# Altium project EXP_HW_V4.PrjPcb
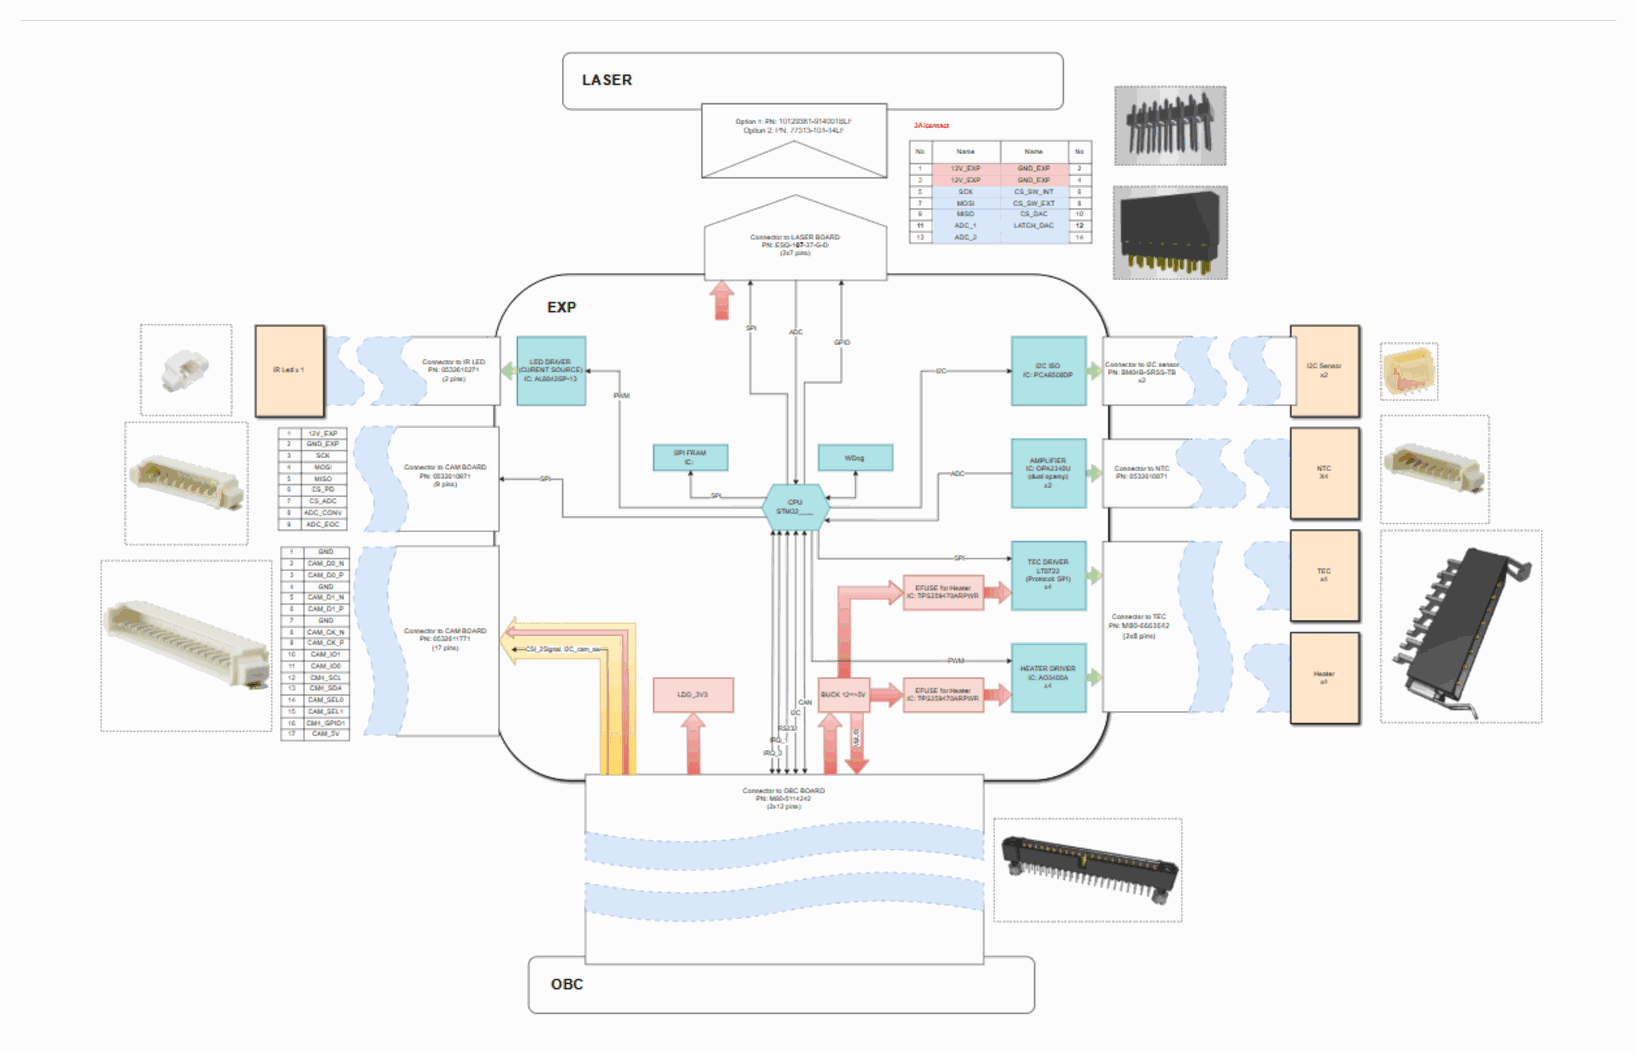
[diagram p0: Block_Diagram.SchDoc]
13 sheets, 359 parts. Net scope: global (net labels, ports and power ports of the same name join across sheets).
Board file: EXP_V122.PcbDoc
Sheets:
  Block_Diagram.SchDoc
  History.SchDoc
  HEADER_1.SchDoc
  HEADER_2.SchDoc
  POWER.SchDoc
  TEC_DRV.SchDoc
  HEATER.SchDoc
  NTC.SchDoc
  I2C_Sensor.SchDoc
  IR_LED.SchDoc
  FRAM.SchDoc
  MCU.SchDoc
  RS485.SchDoc

## Sheet Block_Diagram.SchDoc
size 420 x 297 mm; SheetNumber: 1; SheetTotal: 12

### Notes on the sheet
- Project:
- BEE-PC1
- Sub-system:
- NANORACK_EXP_CONTROLLER
- Design by:
- SANG HUYNH
- BAO BUI Q.
- Sheet title:
- Sheet
- A3
- of
- Checked by:
- Approved by:
- VU PHAM
- Revision:
- Document No:
- V1.1.1
- Size:
- Date:

## Sheet History.SchDoc
size 420 x 297 mm; SheetNumber: 2; SheetTotal: 13
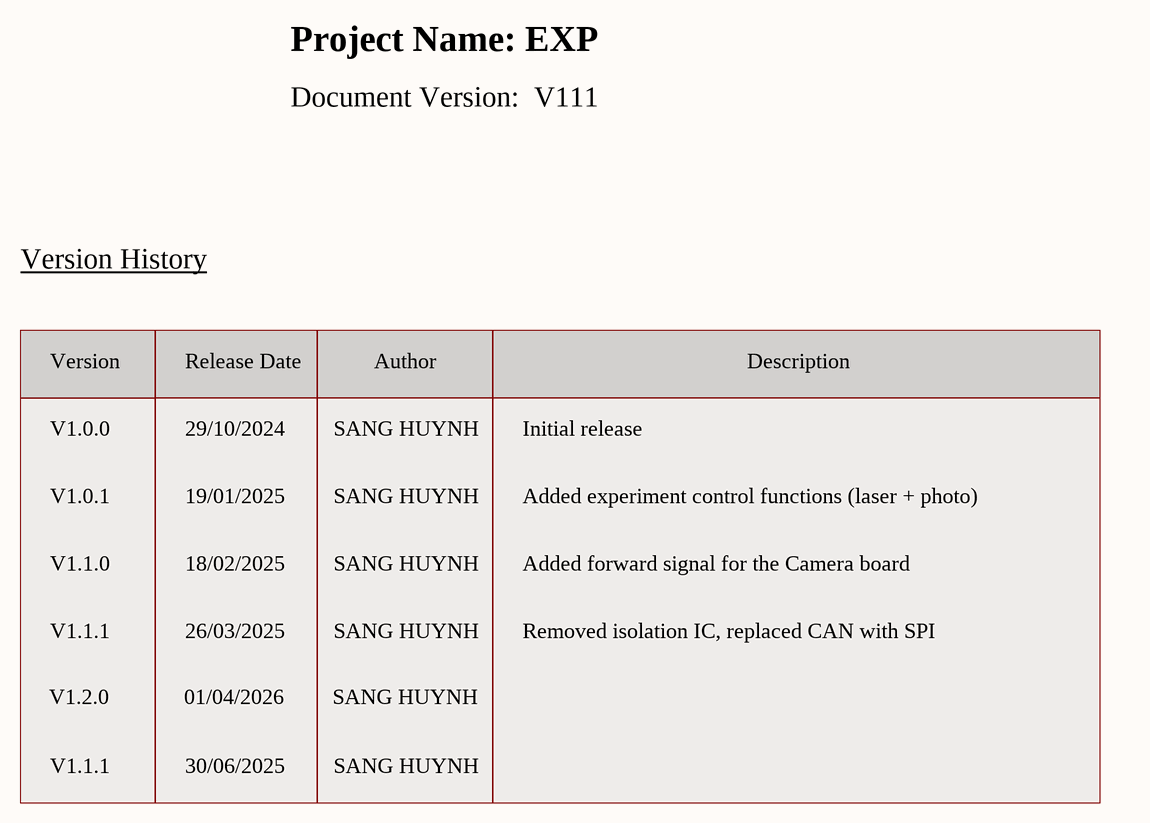
[diagram p1: History.SchDoc]

### Notes on the sheet
- Project Name: EXP
- Document Version:  V111
- Version History
- Version
- Release Date
- Author
- Description
- V1.0.0
- 29/10/2024
- SANG HUYNH
- Initial release
- V1.0.1
- 19/01/2025
- Added experiment control functions (laser + photo)
- V1.1.0
- 18/02/2025
- Added forward signal for the Camera board
- V1.1.1
- 26/03/2025
- Removed isolation IC, replaced CAN with SPI
- V1.2.0
- 01/04/2026
- 30/06/2025
- Project:
- BEE-PC1
- Sub-system:
- NANORACK_EXP_CONTROLLER
- Design by:
- BAO BUI Q.
- Sheet title:
- Sheet
- A3
- of
- Checked by:
- Approved by:
- VU PHAM
- Revision:
- Document No:
- Size:
- Date:

## Sheet HEADER_1.SchDoc
size 420 x 297 mm; SheetNumber: 3; SheetTotal: 13
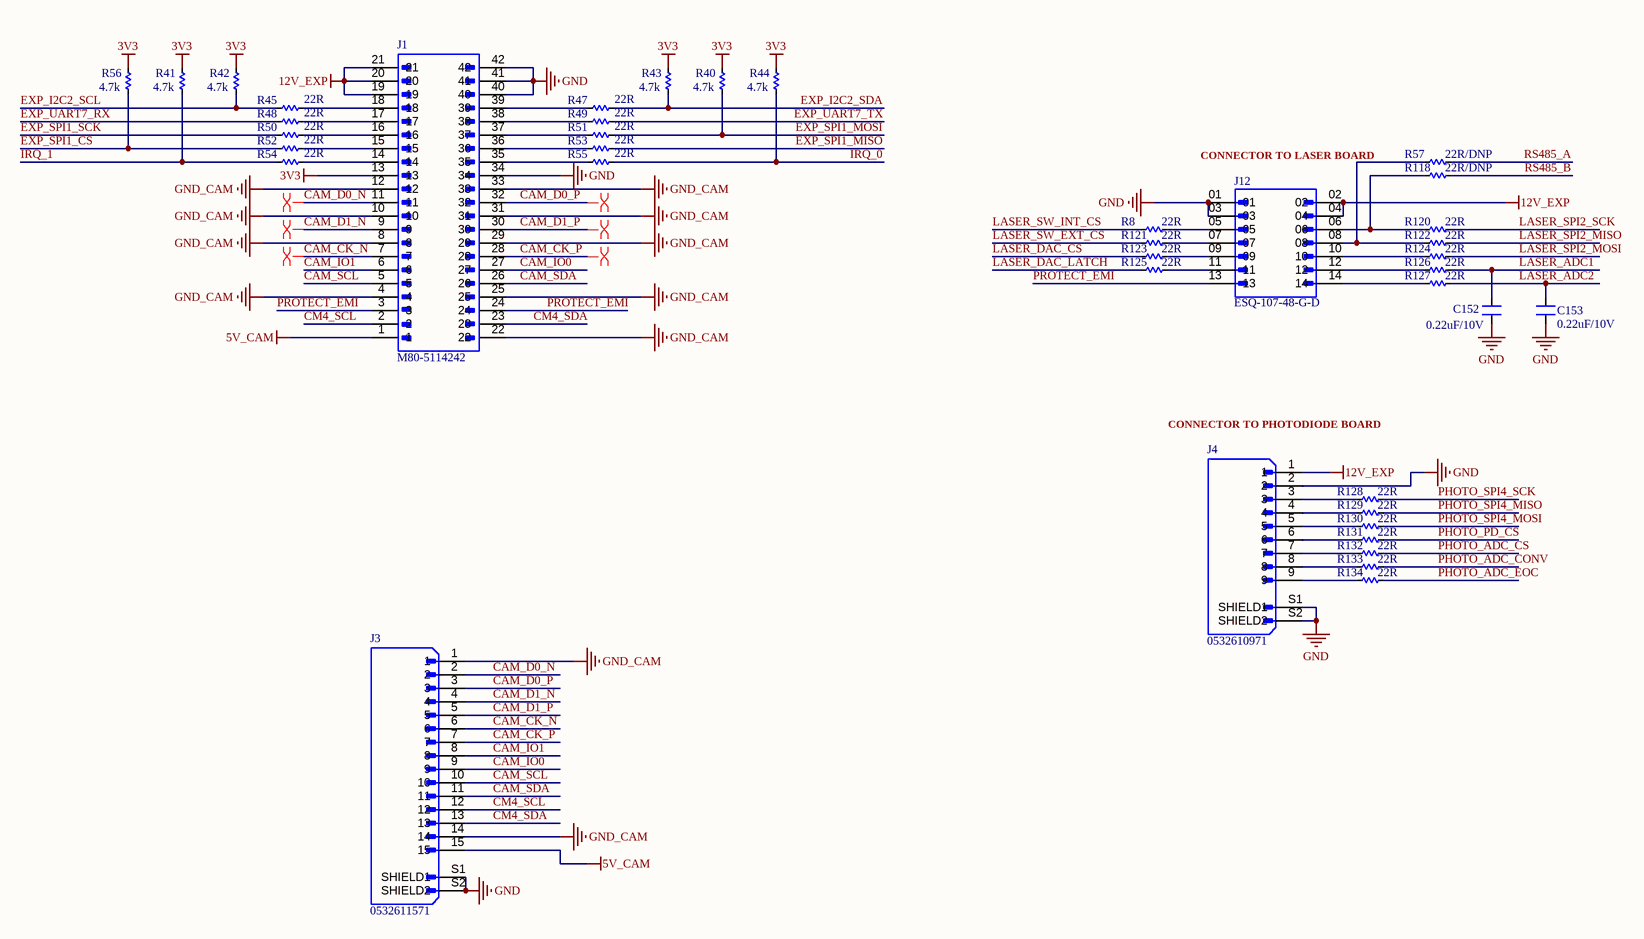
[diagram p2: HEADER_1.SchDoc]

### Parts
C152  0.22uF/10V  [CAP_C_1608X80]
C153  0.22uF/10V  [CAP_C_1608X80]
J1  M80-5114242  [M80-5114242]
J3  0532611571  [0532611571]
J4  0532610971  [0532610971]
J12  ESQ-107-48-G-D  [ESQ-107-37-G-D]
R8  22R  [RES_C_1608X60]
R40  4.7k  [RES_C_1608X60]
R41  4.7k  [RES_C_1608X60]
R42  4.7k  [RES_C_1608X60]
R43  4.7k  [RES_C_1608X60]
R44  4.7k  [RES_C_1608X60]
R45  22R  [RES_C_1608X60]
R47  22R  [RES_C_1608X60]
R48  22R  [RES_C_1608X60]
R49  22R  [RES_C_1608X60]
R50  22R  [RES_C_1608X60]
R51  22R  [RES_C_1608X60]
R52  22R  [RES_C_1608X60]
R53  22R  [RES_C_1608X60]
R54  22R  [RES_C_1608X60]
R55  22R  [RES_C_1608X60]
R56  4.7k  [RES_C_1608X60]
R57  22R/DNP  [RES_C_1608X60]
R118  22R/DNP  [RES_C_1608X60]
R120  22R  [RES_C_1608X60]
R121  22R  [RES_C_1608X60]
R122  22R  [RES_C_1608X60]
R123  22R  [RES_C_1608X60]
R124  22R  [RES_C_1608X60]
R125  22R  [RES_C_1608X60]
R126  22R  [RES_C_1608X60]
R127  22R  [RES_C_1608X60]
R128  22R  [RES_C_1608X60]
R129  22R  [RES_C_1608X60]
R130  22R  [RES_C_1608X60]
R131  22R  [RES_C_1608X60]
R132  22R  [RES_C_1608X60]
R133  22R  [RES_C_1608X60]
R134  22R  [RES_C_1608X60]

### Nets
3V3: J1.13 R40.1 R41.1 R42.1 R43.1 R44.1 R56.1  [project net +3.3]
5V_CAM: J1.1 J3.15
12V_EXP: J1.19 J1.20 J1.21 J4.1 J12.02 J12.04
GND: C152.1 C153.1 J1.34 J1.40 J1.41 J1.42 J3.S1(SHIELD1) J3.S2(SHIELD2) J4.2 J4.S1(SHIELD1) J4.S2(SHIELD2) J12.01 J12.03
GND_CAM: J1.4 J1.8 J1.10 J1.12 J1.22 J1.25 J1.29 J1.31 J1.33 J3.1 J3.14
CAM_CK_N: J1.7 J3.6
CAM_CK_P: J1.28 J3.7
CAM_D0_N: J1.11 J3.2
CAM_D0_P: J1.32 J3.3
CAM_D1_N: J1.9 J3.4
CAM_D1_P: J1.30 J3.5
CAM_IO0: J1.27 J3.9
CAM_IO1: J1.6 J3.8
CAM_SCL: J1.5 J3.10
CAM_SDA: J1.26 J3.11
CM4_SCL: J1.2 J3.12
CM4_SDA: J1.23 J3.13
EXP_I2C2_SCL: R42.2 R45.1
EXP_I2C2_SDA: R43.2 R47.2
EXP_SPI1_CS: R52.1 R56.2
EXP_SPI1_MISO: R53.2
EXP_SPI1_MOSI: R40.2 R51.2
EXP_SPI1_SCK: R50.1
EXP_UART7_RX: R48.1
EXP_UART7_TX: R49.2
IRQ_0: R44.2 R55.2
IRQ_1: R41.2 R54.1
LASER_ADC1: C152.2 R126.2
LASER_ADC2: C153.2 R127.2
LASER_DAC_CS: R123.1
LASER_DAC_LATCH: R125.1
LASER_SPI2_MISO: R122.2
LASER_SPI2_MOSI: R124.2
LASER_SPI2_SCK: R120.2
LASER_SW_EXT_CS: R121.1
LASER_SW_INT_CS: R8.1
PHOTO_ADC_CONV: R133.2
PHOTO_ADC_CS: R132.2
PHOTO_ADC_EOC: R134.2
PHOTO_PD_CS: R131.2
PHOTO_SPI4_MISO: R129.2
PHOTO_SPI4_MOSI: R130.2
PHOTO_SPI4_SCK: R128.2
PROTECT_EMI: J1.3 J1.24 J12.13
RS485_A: R57.2
RS485_B: R118.2
NetJ1_14: J1.14 R54.2
NetJ1_15: J1.15 R52.2
NetJ1_16: J1.16 R50.2
NetJ1_17: J1.17 R48.2
NetJ1_18: J1.18 R45.2
NetJ1_35: J1.35 R55.1
NetJ1_36: J1.36 R53.1
NetJ1_37: J1.37 R51.1
NetJ1_38: J1.38 R49.1
NetJ1_39: J1.39 R47.1
NetJ4_3: J4.3 R128.1
NetJ4_4: J4.4 R129.1
NetJ4_5: J4.5 R130.1
NetJ4_6: J4.6 R131.1
NetJ4_7: J4.7 R132.1
NetJ4_8: J4.8 R133.1
NetJ4_9: J4.9 R134.1
NetJ12_05: J12.05 R8.2
NetJ12_06: J12.06 R118.1 R120.1
NetJ12_07: J12.07 R121.2
NetJ12_08: J12.08 R57.1 R122.1
NetJ12_09: J12.09 R123.2
NetJ12_10: J12.10 R124.1
NetJ12_11: J12.11 R125.2
NetJ12_12: J12.12 R126.1
NetJ12_14: J12.14 R127.1

### Layout directives
differential pair; differential pair class DIF100: CAM_CK_N, CAM_CK_P, CAM_D0_N, CAM_D0_P, CAM_D1_N, CAM_D1_P

### Notes on the sheet
- (near J12) CONNECTOR TO LASER BOARD
- (near J4) CONNECTOR TO PHOTODIODE BOARD
- Project:
- BEE-PC1
- Sub-system:
- NANORACK_EXP_CONTROLLER
- Design by:
- SANG HUYNH
- BAO BUI Q.
- Sheet title:
- Sheet
- A3
- of
- Checked by:
- Approved by:
- VU PHAM
- Revision:
- Document No:
- V1.1.1
- Size:
- Date:

### Library data of the parts
C152 C153 = Capacitors: Value: 33pF
J1 = CONN_TH_42: CONN HEADER VERT 42POS 2MM
J3 = CONN_SMD_15: Conn Shrouded Header (4 Sides) HDR 15 POS 1.25mm Solder RA Side Entry SMD PicoBladeâ„¢ T/R; MF: Molex; Package: None; MP: 532611571; Check_prices: https://www.snapeda.com/parts/532611571/Molex/view-part/?ref=eda; Purchase-URL: https://pricing.snapeda.com/search/part/532611571/?ref=eda; Value: *; Availability: In Stock; Price: None; SnapEDA_Link: https://www.snapeda.com/parts/532611571/Molex/view-part/?ref=snap
J4 = CONN_SMD_09: CONN HEADER SMD R/A 9POS 1.25MM
J12 = CONN_TH_14: CONN SOCKET 14POS 0.1 GOLD PCB
R8 R40-R45 R47-R57 R118 R120-R134 = Res SMD: SMD; Manufacturer: Generic Components; Class: Passive; Published: 08/06/2000; Publisher: Altium Hobart Technology Centre

## Sheet HEADER_2.SchDoc
size 420 x 297 mm; SheetNumber: 3; SheetTotal: 11
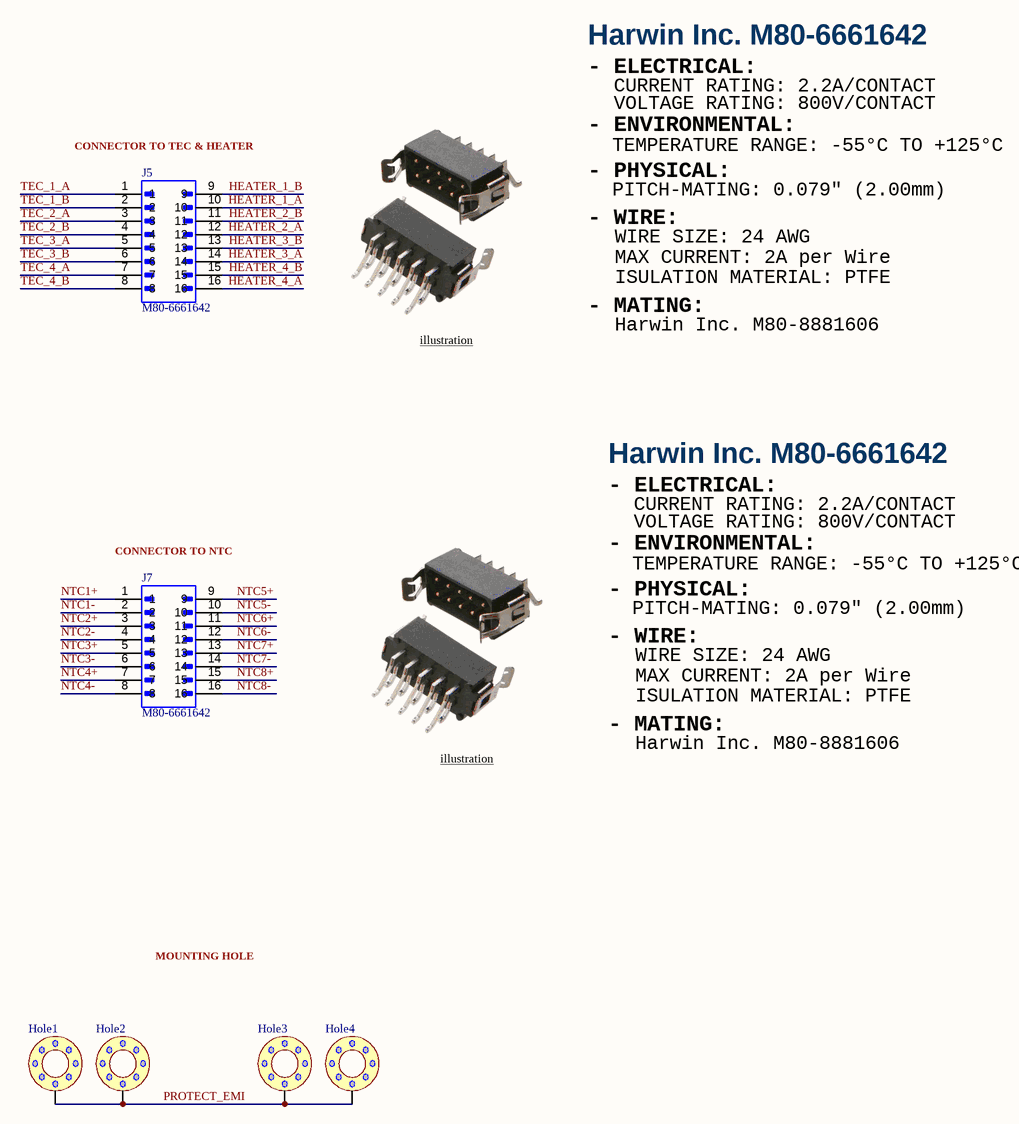
[diagram p3: HEADER_2.SchDoc]

### Parts
Hole1  hole_space  [HOLE_SPACE]  (value not drawn)
Hole2  hole_space  [HOLE_SPACE]  (value not drawn)
Hole3  hole_space  [HOLE_SPACE]  (value not drawn)
Hole4  hole_space  [HOLE_SPACE]  (value not drawn)
J5  M80-6661642  [M80-6661642]
J7  M80-6661642  [M80-6661642]

### Nets
HEATER_1_A: J5.10 J5.12 J5.14 J5.16  [also labelled HEATER_2_A, HEATER_3_A, HEATER_4_A]  [project net 5V_TEMP]
NTC1+: J7.1 J7.3 J7.5 J7.7 J7.9 J7.11 J7.13 J7.15  [also labelled NTC2+, NTC3+, NTC4+, NTC5+, NTC6+, NTC7+, NTC8+]  [project net +3.3]
HEATER_1_B: J5.9
HEATER_2_B: J5.11
HEATER_3_B: J5.13
HEATER_4_B: J5.15
NTC1-: J7.2
NTC2-: J7.4
NTC3-: J7.6
NTC4-: J7.8
NTC5-: J7.10
NTC6-: J7.12
NTC7-: J7.14
NTC8-: J7.16
PROTECT_EMI: Hole1.1 Hole2.1 Hole3.1 Hole4.1
TEC_1_A: J5.1
TEC_1_B: J5.2
TEC_2_A: J5.3
TEC_2_B: J5.4
TEC_3_A: J5.5
TEC_3_B: J5.6
TEC_4_A: J5.7
TEC_4_B: J5.8

### Notes on the sheet
- Harwin Inc. M80-6661642
- - ELECTRICAL:
- CURRENT RATING: 2.2A/CONTACT
- VOLTAGE RATING: 800V/CONTACT
- (near J5) CONNECTOR TO TEC & HEATER
- - ENVIRONMENTAL:
- - PHYSICAL:
- TEMPERATURE RANGE: -55°C TO +125°C
- - WIRE:
- PITCH-MATING: 0.079" (2.00mm)
- WIRE SIZE: 24 AWG
- - MATING:
- MAX CURRENT: 2A per Wire
- ISULATION MATERIAL: PTFE
- illustration
- Harwin Inc. M80-8881606
- (near J7) CONNECTOR TO NTC
- MOUNTING HOLE
- Project:
- BEE-PC1
- Sub-system:
- NANORACK_EXP_CONTROLLER
- Design by:
- SANG HUYNH
- BAO BUI Q.
- Sheet title:
- Sheet
- A3
- of
- Checked by:
- Approved by:
- VU PHAM
- Revision:
- Document No:
- V1.1.1
- Size:
- Date:

### Library data of the parts
J5 J7 = CONN_SMD_16: CONN HEADER SMD R/A 16POS 2MM

## Sheet POWER.SchDoc
size 420 x 297 mm; SheetNumber: 4; SheetTotal: 11
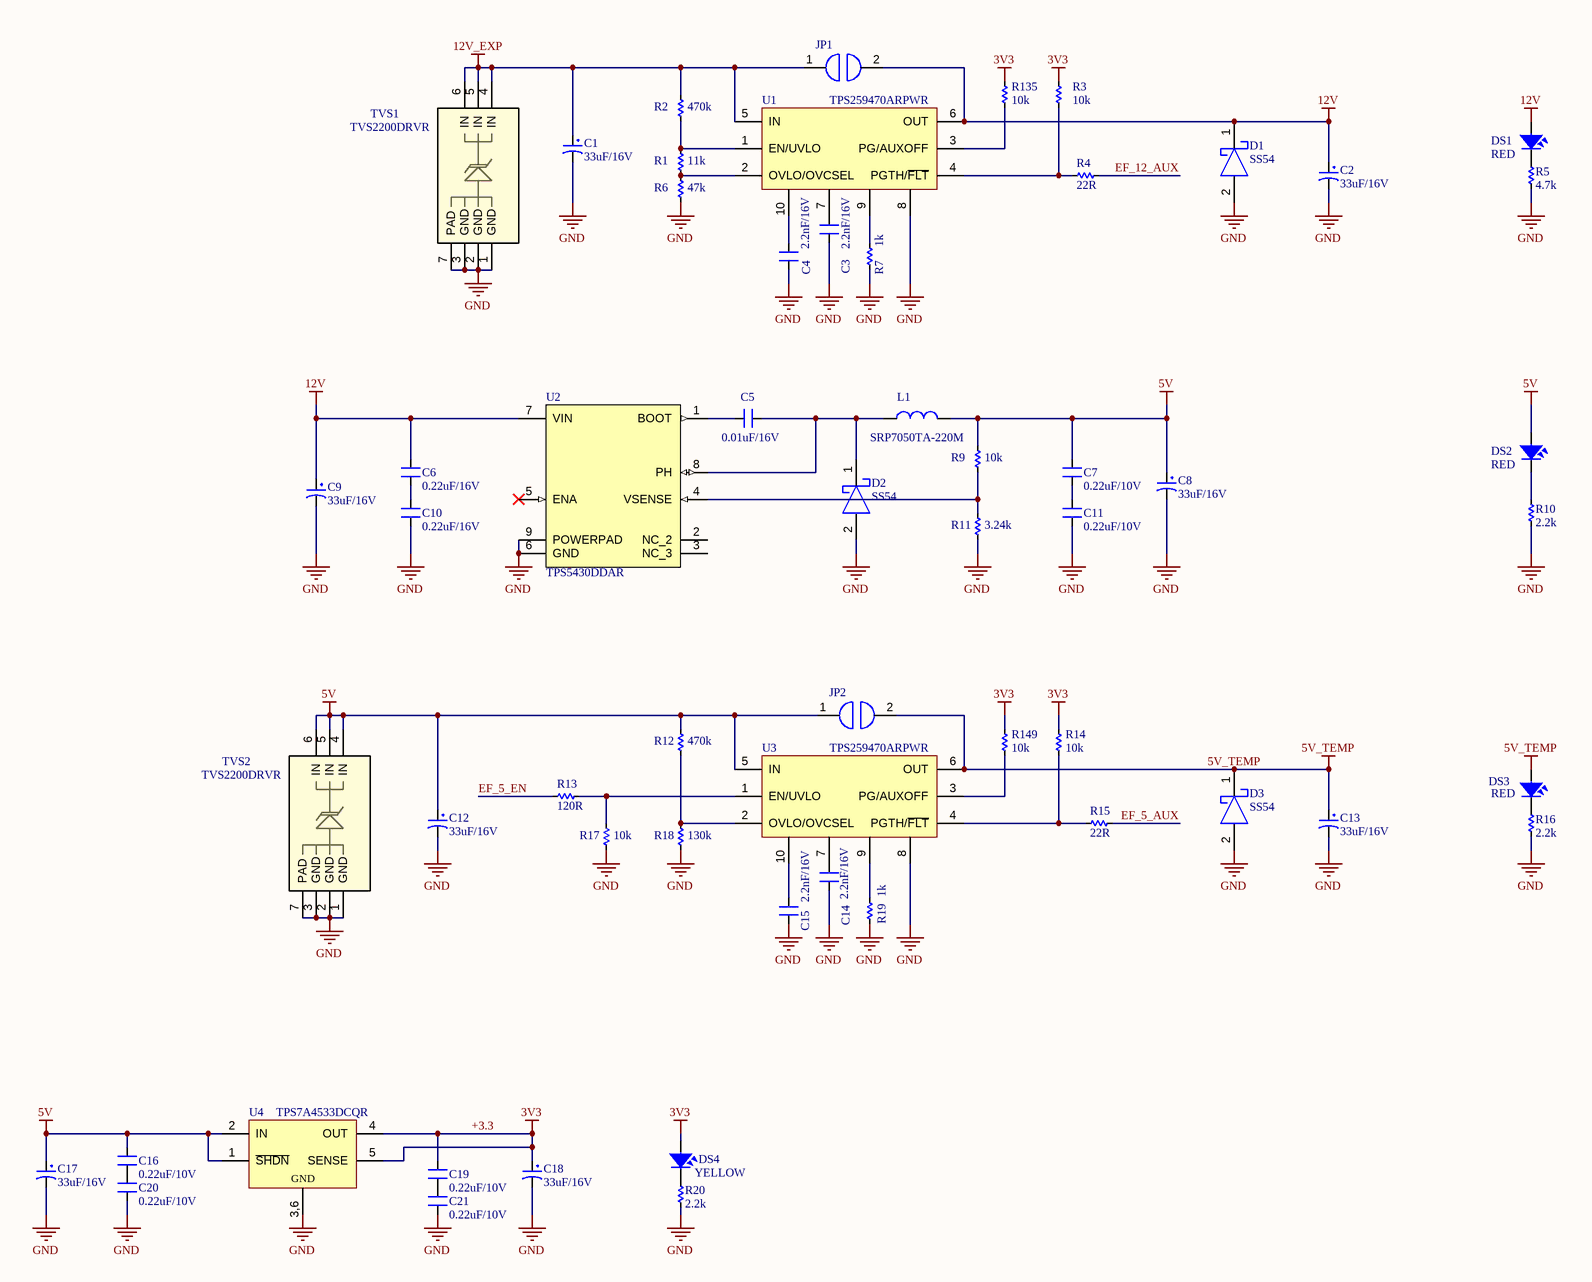
[diagram p4: POWER.SchDoc]

### Parts
C1  33uF/16V  [TANTALUM-SMD-1206]
C2  33uF/16V  [TANTALUM-SMD-1206]
C3  2.2nF/16V  [CAP_C_1608X80]
C4  2.2nF/16V  [CAP_C_1608X80]
C5  0.01uF/16V  [CAP_C_1608X80]
C6  0.22uF/16V  [CAP_C_1608X80]
C7  0.22uF/10V  [CAP_C_1608X80]
C8  33uF/16V  [TANTALUM-SMD-1206]
C9  33uF/16V  [TANTALUM-SMD-1206]
C10  0.22uF/16V  [CAP_C_1608X80]
C11  0.22uF/10V  [CAP_C_1608X80]
C12  33uF/16V  [TANTALUM-SMD-1206]
C13  33uF/16V  [TANTALUM-SMD-1206]
C14  2.2nF/16V  [CAP_C_1608X80]
C15  2.2nF/16V  [CAP_C_1608X80]
C16  0.22uF/10V  [CAP_C_1608X80]
C17  33uF/16V  [TANTALUM-SMD-1206]
C18  33uF/16V  [TANTALUM-SMD-1206]
C19  0.22uF/10V  [CAP_C_1608X80]
C20  0.22uF/10V  [CAP_C_1608X80]
C21  0.22uF/10V  [CAP_C_1608X80]
D1  SS54  [DO214-AC-SMA]
D2  SS54  [DO214-AC-SMA]
D3  SS54  [DO214-AC-SMA]
DS1  RED  [LED-0603-BLUE]
DS2  RED  [LED-0603-BLUE]
DS3  RED  [LED-0603-BLUE]
DS4  YELLOW  [LED-0603-BLUE]
JP1  jumper2  [JUMPER]  (value not drawn)
JP2  jumper2  [JUMPER]  (value not drawn)
L1  SRP7050TA-220M  [PSM6050]
R1  11k  [RES_C_1608X60]
R2  470k  [RES_C_1608X60]
R3  10k  [RES_C_1608X60]
R4  22R  [RES_C_1608X60]
R5  4.7k  [RES_C_1608X60]
R6  47k  [RES_C_1608X60]
R7  1k  [RES_C_1608X60]
R9  10k  [RES_C_1608X60]
R10  2.2k  [RES_C_1608X60]
R11  3.24k  [RES_C_1608X60]
R12  470k  [RES_C_1608X60]
R13  120R  [RES_C_1608X60]
R14  10k  [RES_C_1608X60]
R15  22R  [RES_C_1608X60]
R16  2.2k  [RES_C_1608X60]
R17  10k  [RES_C_1608X60]
R18  130k  [RES_C_1608X60]
R19  1k  [RES_C_1608X60]
R20  2.2k  [RES_C_1608X60]
R135  10k  [RES_C_1608X60]
R149  10k  [RES_C_1608X60]
TVS1  TVS2200DRVR  [TVS2200]
TVS2  TVS2200DRVR  [TVS2200]
U1  TPS259470ARPWR  [VQFN-HR-10]
U2  TPS5430DDAR  [TPS5430DDAR_V3]
U3  TPS259470ARPWR  [VQFN-HR-10]
U4  TPS7A4533DCQR  [SOT223_6]

### Nets
5V: C7.2 C8.1 C12.1 C16.2 C17.1 DS2.1 JP2.1 L1.2 R9.1 R12.1 TVS2.4(IN) TVS2.5(IN) TVS2.6(IN) U3.5(IN) U4.1(~{SHDN}) U4.2(IN)
5V_TEMP: C13.1 D3.1 DS3.1 JP2.2 U3.6(OUT)
12V: C2.1 C6.2 C9.1 D1.1 DS1.1 JP1.2 U1.6(OUT) U2.7(VIN)
12V_EXP: C1.1 JP1.1 R2.1 TVS1.4(IN) TVS1.5(IN) TVS1.6(IN) U1.5(IN)
+3.3: C18.1 C19.2 DS4.1 R3.1 R14.1 R135.1 R149.1 U4.4(OUT) U4.5(SENSE)  [also labelled 3V3]
GND: C1.2 C2.2 C3.1 C4.1 C8.2 C9.2 C10.1 C11.1 C12.2 C13.2 C14.1 C15.1 C17.2 C18.2 C20.1 C21.1 D1.2 D2.2 D3.2 R5.2 R6.2 R7.2 R10.2 R11.2 R16.2 R17.2 R18.2 R19.2 R20.2 TVS1.1(GND) TVS1.2(GND) TVS1.3(GND) TVS1.7(PAD) TVS2.1(GND) TVS2.2(GND) TVS2.3(GND) TVS2.7(PAD) U1.8 U2.6(GND) U2.9(POWERPAD) U3.8 U4.3,6(GND)
EF_5_AUX: R15.2
EF_5_EN: R13.1
EF_12_AUX: R4.2
NetC3_2: C3.2 U1.7
NetC4_2: C4.2 U1.10
NetC5_1: C5.1 D2.1 L1.1 U2.8(PH)
NetC5_2: C5.2 U2.1(BOOT)
NetC6_1: C6.1 C10.2
NetC7_1: C7.1 C11.2
NetC14_2: C14.2 U3.7
NetC15_2: C15.2 U3.10
NetC16_1: C16.1 C20.2
NetC19_1: C19.1 C21.2
NetDS1_2: DS1.2 R5.1
NetDS2_2: DS2.2 R10.1
NetDS3_2: DS3.2 R16.1
NetDS4_2: DS4.2 R20.1
NetR1_1: R1.1 R2.2 U1.1(EN/UVLO)
NetR1_2: R1.2 R6.1 U1.2(OVLO/OVCSEL)
NetR3_2: R3.2 R4.1 U1.4(PGTH/~{FLT})
NetR7_1: R7.1 U1.9
NetR9_2: R9.2 R11.1 U2.4(VSENSE)
NetR12_2: R12.2 R18.1 U3.2(OVLO/OVCSEL)
NetR13_2: R13.2 R17.1 U3.1(EN/UVLO)
NetR14_2: R14.2 R15.1 U3.4(PGTH/~{FLT})
NetR19_1: R19.1 U3.9
NetR135_2: R135.2 U1.3(PG/AUXOFF)
NetR149_2: R149.2 U3.3(PG/AUXOFF)

Not connected (* = marked no-connect by the designer): U2 2(NC_2) 3(NC_3) 5(ENA)*

### Notes on the sheet
- Project:
- BEE-PC1
- Sub-system:
- NANORACK_EXP_CONTROLLER
- Design by:
- SANG HUYNH
- BAO BUI Q.
- Sheet title:
- Sheet
- A3
- of
- Checked by:
- Approved by:
- VU PHAM
- Revision:
- Document No:
- V1.1.1
- Size:
- Date:

### Library data of the parts
C1 C2 C8 C9 C12 C13 C17 C18 = Cap_Tantalum SMD: SMD; Chung_Loai: Dán; Don_Vi: Con; So_Chan: 2; Ten_Linh_Kien: Tụ tantalum 477A-470uF 10V SMD7343; Ma_Hang: MH001956; Kieu_Chan: *
C3-C7 C10 C11 C14-C16 C19-C21 = Capacitors: Value: 33pF
D1-D3 = SS54: DIODE SCHOTTKY 60V 3A DO214AA
DS1-DS4 = LED SMD: Value: LED 3 - 5 ly 2 Colour
JP1 JP2 = JUMPER
L1 = SRP7050TA-220M: FIXED IND 22UH 2.5A 170 MOHM SMD
R1-R7 R9-R20 R135 R149 = Res SMD: as R8 on sheet HEADER_1; Published: 08/06/2000; Publisher: Altium Hobart Technology Centre
TVS1 TVS2 = TVS2200: UNIDIR PRECISION SURGE DIODE
U2 = TPS5430DDAR: IC REG BUCK ADJ 3A 8SOPWR
U4 = TPS7A4533DCQR: IC REG LINEAR 3.3V 1.5A SOT223-6

## Sheet TEC_DRV.SchDoc
size 420 x 297 mm; SheetNumber: 5; SheetTotal: 11
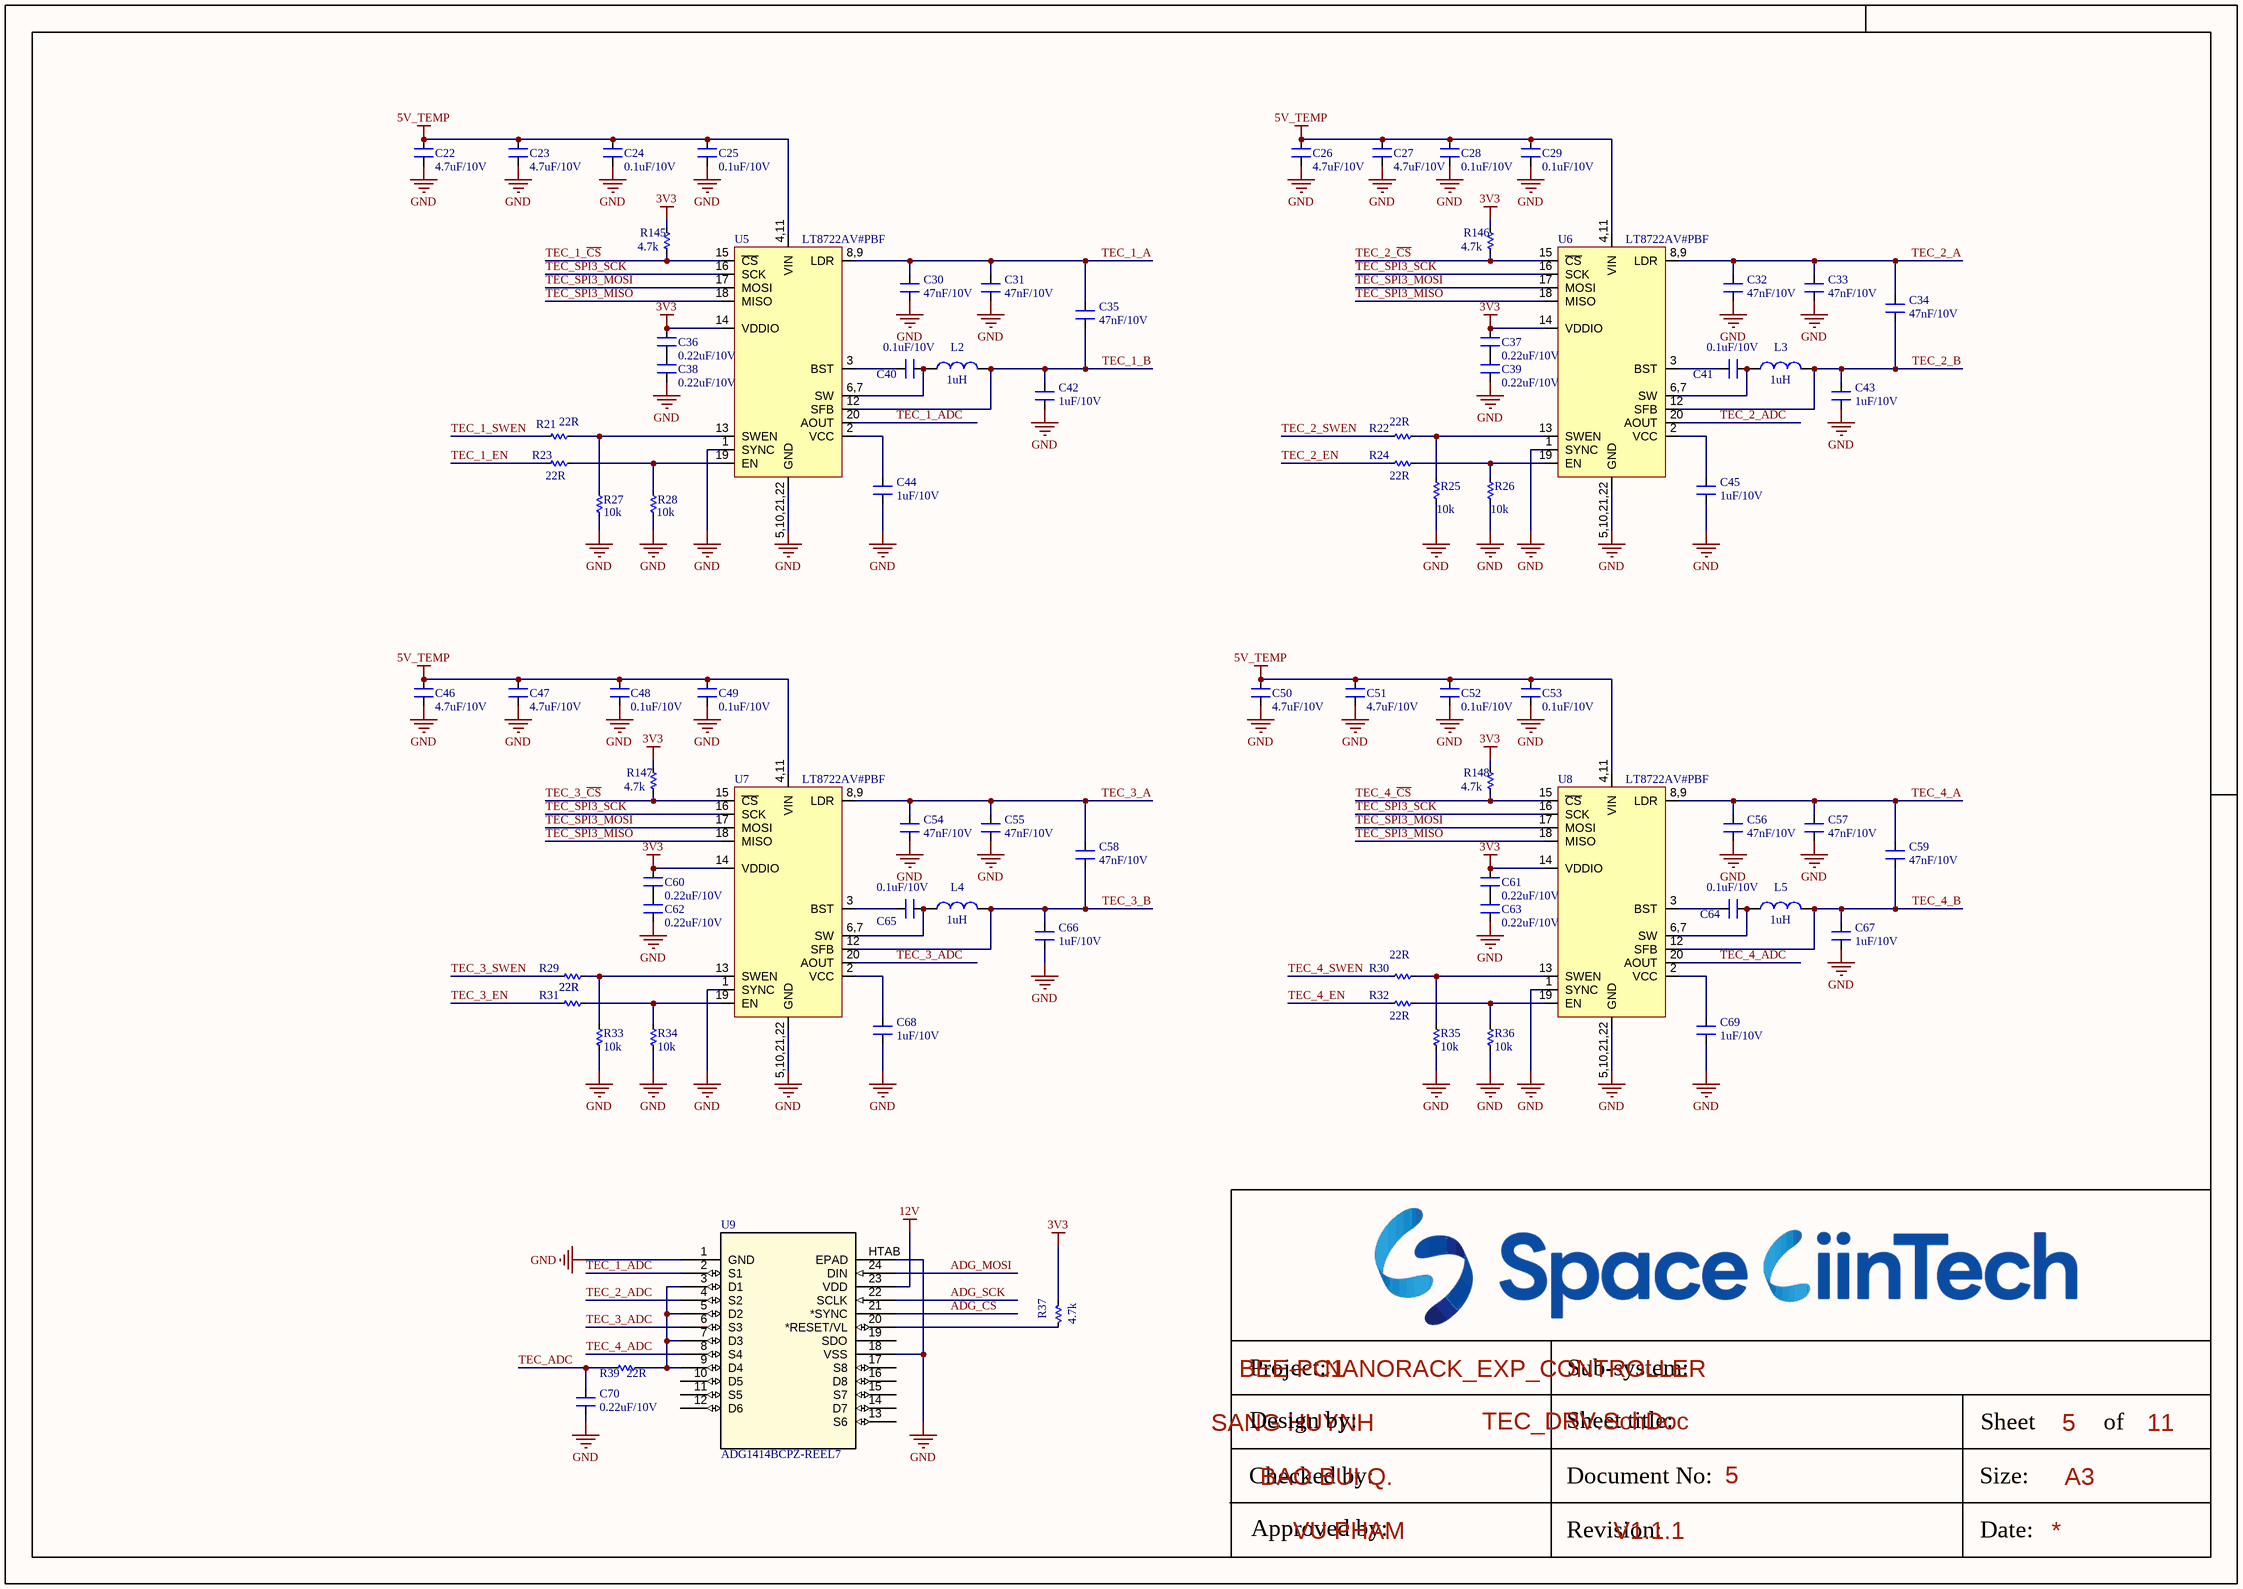
[diagram p5: TEC_DRV.SchDoc]

### Parts
C22  4.7uF/10V  [CAP_C_1608X80]
C23  4.7uF/10V  [CAP_C_1608X80]
C24  0.1uF/10V  [CAP_C_1608X80]
C25  0.1uF/10V  [CAP_C_1608X80]
C26  4.7uF/10V  [CAP_C_1608X80]
C27  4.7uF/10V  [CAP_C_1608X80]
C28  0.1uF/10V  [CAP_C_1608X80]
C29  0.1uF/10V  [CAP_C_1608X80]
C30  47nF/10V  [CAP_C_1608X80]
C31  47nF/10V  [CAP_C_1608X80]
C32  47nF/10V  [CAP_C_1608X80]
C33  47nF/10V  [CAP_C_1608X80]
C34  47nF/10V  [CAP_C_1608X80]
C35  47nF/10V  [CAP_C_1608X80]
C36  0.22uF/10V  [CAP_C_1608X80]
C37  0.22uF/10V  [CAP_C_1608X80]
C38  0.22uF/10V  [CAP_C_1608X80]
C39  0.22uF/10V  [CAP_C_1608X80]
C40  0.1uF/10V  [CAP_C_1608X80]
C41  0.1uF/10V  [CAP_C_1608X80]
C42  1uF/10V  [CAP_C_1608X80]
C43  1uF/10V  [CAP_C_1608X80]
C44  1uF/10V  [CAP_C_1608X80]
C45  1uF/10V  [CAP_C_1608X80]
C46  4.7uF/10V  [CAP_C_1608X80]
C47  4.7uF/10V  [CAP_C_1608X80]
C48  0.1uF/10V  [CAP_C_1608X80]
C49  0.1uF/10V  [CAP_C_1608X80]
C50  4.7uF/10V  [CAP_C_1608X80]
C51  4.7uF/10V  [CAP_C_1608X80]
C52  0.1uF/10V  [CAP_C_1608X80]
C53  0.1uF/10V  [CAP_C_1608X80]
C54  47nF/10V  [CAP_C_1608X80]
C55  47nF/10V  [CAP_C_1608X80]
C56  47nF/10V  [CAP_C_1608X80]
C57  47nF/10V  [CAP_C_1608X80]
C58  47nF/10V  [CAP_C_1608X80]
C59  47nF/10V  [CAP_C_1608X80]
C60  0.22uF/10V  [CAP_C_1608X80]
C61  0.22uF/10V  [CAP_C_1608X80]
C62  0.22uF/10V  [CAP_C_1608X80]
C63  0.22uF/10V  [CAP_C_1608X80]
C64  0.1uF/10V  [CAP_C_1608X80]
C65  0.1uF/10V  [CAP_C_1608X80]
C66  1uF/10V  [CAP_C_1608X80]
C67  1uF/10V  [CAP_C_1608X80]
C68  1uF/10V  [CAP_C_1608X80]
C69  1uF/10V  [CAP_C_1608X80]
C70  0.22uF/10V  [CAP_C_1608X80]
L2  1uH  [L-SMD-M-3.5x3.5x2mm]
L3  1uH  [L-SMD-M-3.5x3.5x2mm]
L4  1uH  [L-SMD-M-3.5x3.5x2mm]
L5  1uH  [L-SMD-M-3.5x3.5x2mm]
R21  22R  [RES_C_1608X60]
R22  22R  [RES_C_1608X60]
R23  22R  [RES_C_1608X60]
R24  22R  [RES_C_1608X60]
R25  10k  [RES_C_1608X60]
R26  10k  [RES_C_1608X60]
R27  10k  [RES_C_1608X60]
R28  10k  [RES_C_1608X60]
R29  22R  [RES_C_1608X60]
R30  22R  [RES_C_1608X60]
R31  22R  [RES_C_1608X60]
R32  22R  [RES_C_1608X60]
R33  10k  [RES_C_1608X60]
R34  10k  [RES_C_1608X60]
R35  10k  [RES_C_1608X60]
R36  10k  [RES_C_1608X60]
R37  4.7k  [RES_C_1608X60]
R39  22R  [RES_C_1608X60]
R145  4.7k  [RES_C_1608X60]
R146  4.7k  [RES_C_1608X60]
R147  4.7k  [RES_C_1608X60]
R148  4.7k  [RES_C_1608X60]
U5  LT8722AV#PBF  [QFN18]
U6  LT8722AV#PBF  [QFN18]
U7  LT8722AV#PBF  [QFN18]
U8  LT8722AV#PBF  [QFN18]
U9  ADG1414BCPZ-REEL7  [ADG1414BCPZ-REEL7]

### Nets
3V3: C36.2 C37.2 C60.2 C61.2 R37.2 R145.1 R146.1 R147.1 R148.1 U5.14(VDDIO) U6.14(VDDIO) U7.14(VDDIO) U8.14(VDDIO)  [project net +3.3]
5V_TEMP: C22.2 C23.2 C24.2 C25.2 C26.2 C27.2 C28.2 C29.2 C46.2 C47.2 C48.2 C49.2 C50.2 C51.2 C52.2 C53.2 U5.4,11(VIN) U6.4,11(VIN) U7.4,11(VIN) U8.4,11(VIN)
12V: U9.23(VDD)
GND: C22.1 C23.1 C24.1 C25.1 C26.1 C27.1 C28.1 C29.1 C30.1 C31.1 C32.1 C33.1 C38.1 C39.1 C42.1 C43.1 C44.1 C45.1 C46.1 C47.1 C48.1 C49.1 C50.1 C51.1 C52.1 C53.1 C54.1 C55.1 C56.1 C57.1 C62.1 C63.1 C66.1 C67.1 C68.1 C69.1 C70.1 R25.2 R26.2 R27.2 R28.2 R33.1 R34.1 R35.1 R36.1 U5.1(SYNC) U5.5,10,21,22(GND) U6.1(SYNC) U6.5,10,21,22(GND) U7.1(SYNC) U7.5,10,21,22(GND) U8.1(SYNC) U8.5,10,21,22(GND) U9.1(GND) U9.18(VSS) U9.HTAB(EPAD)
ADG_CS: U9.21(*SYNC)
ADG_MOSI: U9.24(DIN)
ADG_SCK: U9.22(SCLK)
TEC_1_A: C30.2 C31.2 C35.2 U5.8,9(LDR)
TEC_1_ADC: U5.20(AOUT) U9.2(S1)
TEC_1_B: C35.1 C42.2 L2.2 U5.12(SFB)
TEC_1_~{CS}: R145.2 U5.15(~{CS})
TEC_1_EN: R23.1
TEC_1_SWEN: R21.1
TEC_2_A: C32.2 C33.2 C34.2 U6.8,9(LDR)
TEC_2_ADC: U6.20(AOUT) U9.4(S2)
TEC_2_B: C34.1 C43.2 L3.2 U6.12(SFB)
TEC_2_~{CS}: R146.2 U6.15(~{CS})
TEC_2_EN: R24.1
TEC_2_SWEN: R22.1
TEC_3_A: C54.2 C55.2 C58.2 U7.8,9(LDR)
TEC_3_ADC: U7.20(AOUT) U9.6(S3)
TEC_3_B: C58.1 C66.2 L4.2 U7.12(SFB)
TEC_3_~{CS}: R147.2 U7.15(~{CS})
TEC_3_EN: R31.1
TEC_3_SWEN: R29.1
TEC_4_A: C56.2 C57.2 C59.2 U8.8,9(LDR)
TEC_4_ADC: U8.20(AOUT) U9.8(S4)
TEC_4_B: C59.1 C67.2 L5.2 U8.12(SFB)
TEC_4_~{CS}: R148.2 U8.15(~{CS})
TEC_4_EN: R32.1
TEC_4_SWEN: R30.1
TEC_ADC: C70.2 R39.1
TEC_SPI3_MISO: U5.18(MISO) U6.18(MISO) U7.18(MISO) U8.18(MISO)
TEC_SPI3_MOSI: U5.17(MOSI) U6.17(MOSI) U7.17(MOSI) U8.17(MOSI)
TEC_SPI3_SCK: U5.16(SCK) U6.16(SCK) U7.16(SCK) U8.16(SCK)
NetC36_1: C36.1 C38.2
NetC37_1: C37.1 C39.2
NetC40_1: C40.1 L2.1 U5.6,7(SW)
NetC40_2: C40.2 U5.3(BST)
NetC41_1: C41.1 L3.1 U6.6,7(SW)
NetC41_2: C41.2 U6.3(BST)
NetC44_2: C44.2 U5.2(VCC)
NetC45_2: C45.2 U6.2(VCC)
NetC60_1: C60.1 C62.2
NetC61_1: C61.1 C63.2
NetC64_1: C64.1 L5.1 U8.6,7(SW)
NetC64_2: C64.2 U8.3(BST)
NetC65_1: C65.1 L4.1 U7.6,7(SW)
NetC65_2: C65.2 U7.3(BST)
NetC68_2: C68.2 U7.2(VCC)
NetC69_2: C69.2 U8.2(VCC)
NetR21_2: R21.2 R27.1 U5.13(SWEN)
NetR22_2: R22.2 R25.1 U6.13(SWEN)
NetR23_2: R23.2 R28.1 U5.19(EN)
NetR24_2: R24.2 R26.1 U6.19(EN)
NetR29_2: R29.2 R33.2 U7.13(SWEN)
NetR30_2: R30.2 R35.2 U8.13(SWEN)
NetR31_2: R31.2 R34.2 U7.19(EN)
NetR32_2: R32.2 R36.2 U8.19(EN)
NetR37_1: R37.1 U9.20(*RESET/VL)
NetR39_2: R39.2 U9.3(D1) U9.5(D2) U9.7(D3) U9.9(D4)

Not connected (* = marked no-connect by the designer): U9 10(D5) 11(S5) 12(D6) 13(S6) 14(D7) 15(S7) 16(D8) 17(S8) 19(SDO)

### Notes on the sheet
- Project:
- BEE-PC1
- Sub-system:
- NANORACK_EXP_CONTROLLER
- Design by:
- SANG HUYNH
- BAO BUI Q.
- Sheet title:
- Sheet
- A3
- of
- Checked by:
- Approved by:
- VU PHAM
- Revision:
- Document No:
- V1.1.1
- Size:
- Date:

### Library data of the parts
C22-C70 = Capacitors: Value: 33pF
L2-L5 = L-SMD-1: partNo: 78477010; Manufacturer: Wurth Elektronik; Inductance: 1.0 μH; ComponentLink1Description: Manufacturer; ComponentLink1URL: http://www.we-online.de; Created by: Baojun Chen; Created Date: Nov.2015; ComponentLink2Description: Datasheet; ComponentLink2URL: http://katalog.we-online.de/pbs/datasheet/78477010.pdf
R21-R37 R39 R145-R148 = Res SMD: as R8 on sheet HEADER_1; Published: 08/06/2000; Publisher: Altium Hobart Technology Centre
U5-U8 = LT8722
U9 = ADG1414: IC SW SPST-NOX8 11.5OHM 24LFCSP

## Sheet HEATER.SchDoc
size 420 x 297 mm; SheetNumber: 7; SheetTotal: 12
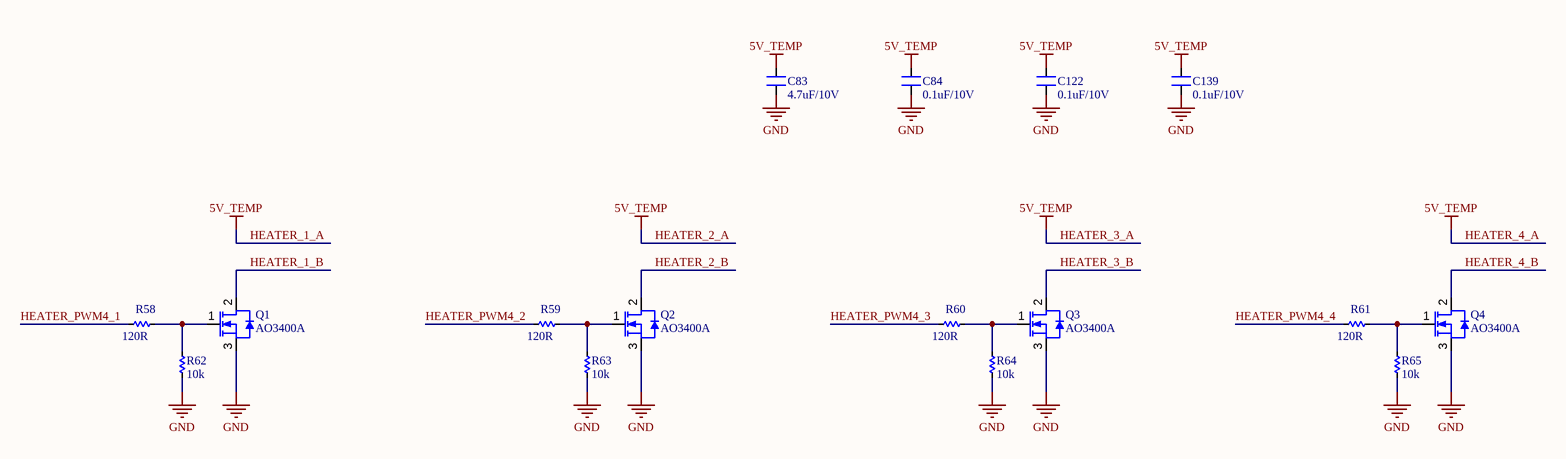
[diagram p6: HEATER.SchDoc]

### Parts
C83  4.7uF/10V  [CAP_C_1608X80]
C84  0.1uF/10V  [CAP_C_1608X80]
C122  0.1uF/10V  [CAP_C_1608X80]
C139  0.1uF/10V  [CAP_C_1608X80]
Q1  AO3400A  [SOT23-13_2]
Q2  AO3400A  [SOT23-13_2]
Q3  AO3400A  [SOT23-13_2]
Q4  AO3400A  [SOT23-13_2]
R58  120R  [RES_C_1608X60]
R59  120R  [RES_C_1608X60]
R60  120R  [RES_C_1608X60]
R61  120R  [RES_C_1608X60]
R62  10k  [RES_C_1608X60]
R63  10k  [RES_C_1608X60]
R64  10k  [RES_C_1608X60]
R65  10k  [RES_C_1608X60]

### Nets
5V_TEMP: C83.2 C84.2 C122.2 C139.2  [also labelled HEATER_1_A, HEATER_2_A, HEATER_3_A, HEATER_4_A]
GND: C83.1 C84.1 C122.1 C139.1 Q1.3(S) Q2.3(S) Q3.3(S) Q4.3(S) R62.1 R63.1 R64.1 R65.1
HEATER_1_B: Q1.2(D)
HEATER_2_B: Q2.2(D)
HEATER_3_B: Q3.2(D)
HEATER_4_B: Q4.2(D)
HEATER_PWM4_1: R58.1
HEATER_PWM4_2: R59.1
HEATER_PWM4_3: R60.1
HEATER_PWM4_4: R61.1
NetQ1_1: Q1.1(G) R58.2 R62.2
NetQ2_1: Q2.1(G) R59.2 R63.2
NetQ3_1: Q3.1(G) R60.2 R64.2
NetQ4_1: Q4.1(G) R61.2 R65.2

### Notes on the sheet
- Project:
- BEE-PC1
- Sub-system:
- NANORACK_EXP_CONTROLLER
- Design by:
- SANG HUYNH
- BAO BUI Q.
- Sheet title:
- Sheet
- A3
- of
- Checked by:
- Approved by:
- VU PHAM
- Revision:
- Document No:
- V1.1.1
- Size:
- Date:

### Library data of the parts
C83 C84 C122 C139 = Capacitors: Value: 33pF
Q1-Q4 = AO3400A: MOSFET N-CH 30V 5.7A SOT23-3L
R58-R65 = Res SMD: as R8 on sheet HEADER_1; Published: 08/06/2000; Publisher: Altium Hobart Technology Centre

## Sheet NTC.SchDoc
size 420 x 297 mm; SheetNumber: 7; SheetTotal: 11
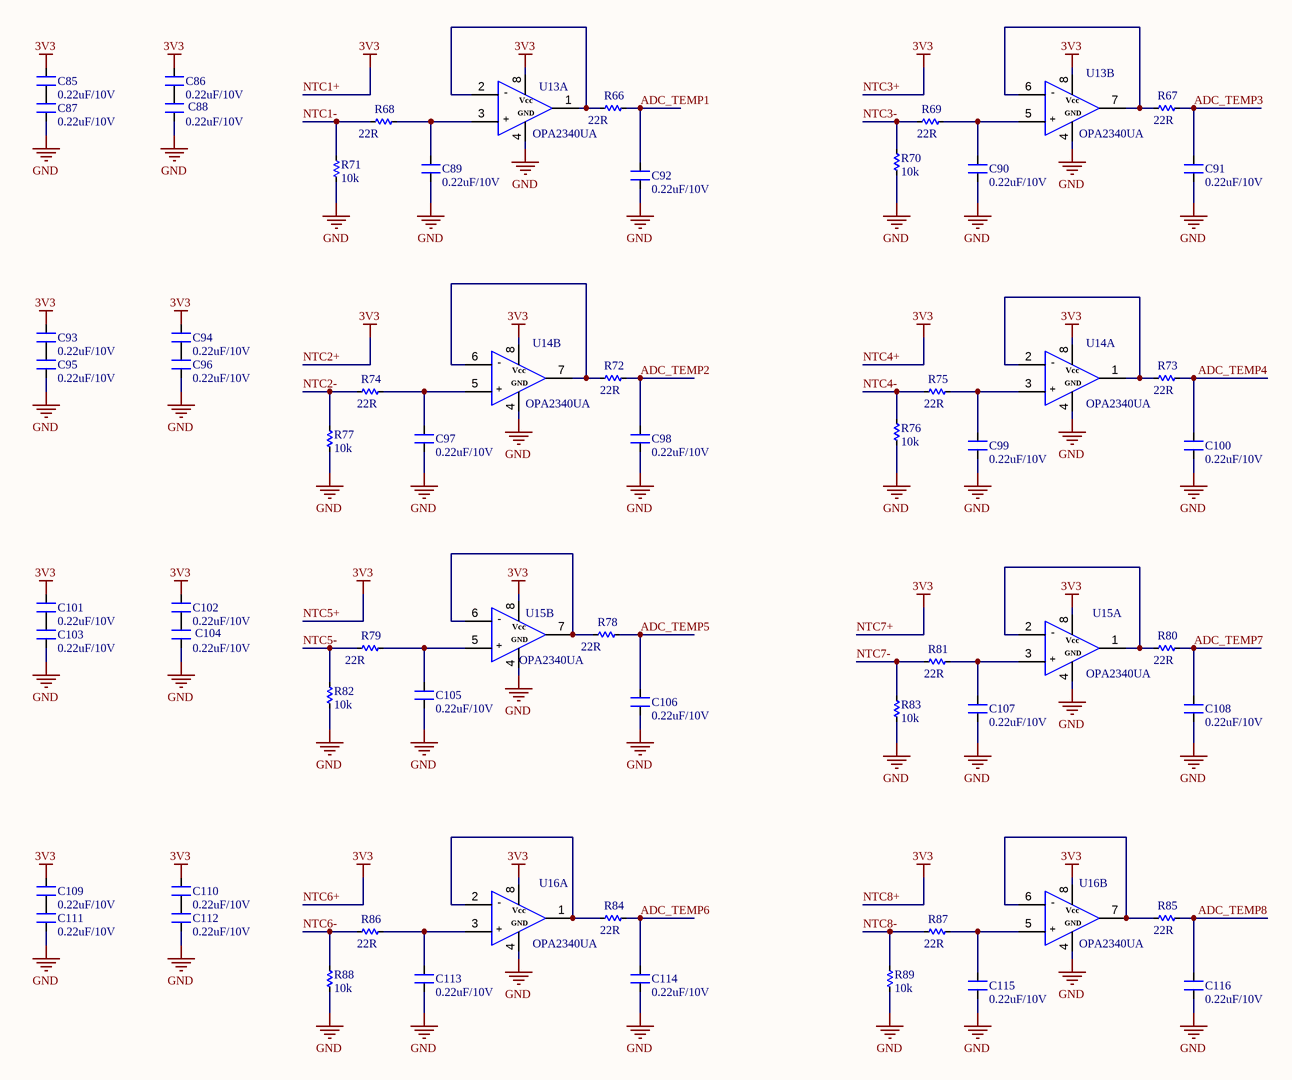
[diagram p7: NTC.SchDoc]

### Parts
C85  0.22uF/10V  [CAP_C_1608X80]
C86  0.22uF/10V  [CAP_C_1608X80]
C87  0.22uF/10V  [CAP_C_1608X80]
C88  0.22uF/10V  [CAP_C_1608X80]
C89  0.22uF/10V  [CAP_C_1608X80]
C90  0.22uF/10V  [CAP_C_1608X80]
C91  0.22uF/10V  [CAP_C_1608X80]
C92  0.22uF/10V  [CAP_C_1608X80]
C93  0.22uF/10V  [CAP_C_1608X80]
C94  0.22uF/10V  [CAP_C_1608X80]
C95  0.22uF/10V  [CAP_C_1608X80]
C96  0.22uF/10V  [CAP_C_1608X80]
C97  0.22uF/10V  [CAP_C_1608X80]
C98  0.22uF/10V  [CAP_C_1608X80]
C99  0.22uF/10V  [CAP_C_1608X80]
C100  0.22uF/10V  [CAP_C_1608X80]
C101  0.22uF/10V  [CAP_C_1608X80]
C102  0.22uF/10V  [CAP_C_1608X80]
C103  0.22uF/10V  [CAP_C_1608X80]
C104  0.22uF/10V  [CAP_C_1608X80]
C105  0.22uF/10V  [CAP_C_1608X80]
C106  0.22uF/10V  [CAP_C_1608X80]
C107  0.22uF/10V  [CAP_C_1608X80]
C108  0.22uF/10V  [CAP_C_1608X80]
C109  0.22uF/10V  [CAP_C_1608X80]
C110  0.22uF/10V  [CAP_C_1608X80]
C111  0.22uF/10V  [CAP_C_1608X80]
C112  0.22uF/10V  [CAP_C_1608X80]
C113  0.22uF/10V  [CAP_C_1608X80]
C114  0.22uF/10V  [CAP_C_1608X80]
C115  0.22uF/10V  [CAP_C_1608X80]
C116  0.22uF/10V  [CAP_C_1608X80]
R66  22R  [RES_C_1608X60]
R67  22R  [RES_C_1608X60]
R68  22R  [RES_C_1608X60]
R69  22R  [RES_C_1608X60]
R70  10k  [RES_C_1608X60]
R71  10k  [RES_C_1608X60]
R72  22R  [RES_C_1608X60]
R73  22R  [RES_C_1608X60]
R74  22R  [RES_C_1608X60]
R75  22R  [RES_C_1608X60]
R76  10k  [RES_C_1608X60]
R77  10k  [RES_C_1608X60]
R78  22R  [RES_C_1608X60]
R79  22R  [RES_C_1608X60]
R80  22R  [RES_C_1608X60]
R81  22R  [RES_C_1608X60]
R82  10k  [RES_C_1608X60]
R83  10k  [RES_C_1608X60]
R84  22R  [RES_C_1608X60]
R85  22R  [RES_C_1608X60]
R86  22R  [RES_C_1608X60]
R87  22R  [RES_C_1608X60]
R88  10k  [RES_C_1608X60]
R89  10k  [RES_C_1608X60]
U13  OPA2340UA  [SO8]  (parts A,B of 2)
U14  OPA2340UA  [SO8]  (parts A,B of 2)
U15  OPA2340UA  [SO8]  (parts A,B of 2)
U16  OPA2340UA  [SO8]  (parts A,B of 2)

### Nets
3V3: C85.2 C86.2 C93.2 C94.2 C101.2 C102.2 C109.2 C110.2 U13.8 U14.8 U15.8 U16.8  [also labelled NTC1+, NTC2+, NTC3+, NTC4+, NTC5+, NTC6+, NTC7+, NTC8+]  [project net +3.3]
GND: C87.1 C88.1 C89.1 C90.1 C91.1 C92.1 C95.1 C96.1 C97.1 C98.1 C99.1 C100.1 C103.1 C104.1 C105.1 C106.1 C107.1 C108.1 C111.1 C112.1 C113.1 C114.1 C115.1 C116.1 R70.2 R71.2 R76.2 R77.2 R82.2 R83.2 R88.2 R89.2 U13.4 U14.4 U15.4 U16.4
ADC_TEMP1: C92.2 R66.2
ADC_TEMP2: C98.2 R72.2
ADC_TEMP3: C91.2 R67.2
ADC_TEMP4: C100.2 R73.2
ADC_TEMP5: C106.2 R78.2
ADC_TEMP6: C114.2 R84.2
ADC_TEMP7: C108.2 R80.2
ADC_TEMP8: C116.2 R85.2
NTC1-: R68.1 R71.1
NTC2-: R74.1 R77.1
NTC3-: R69.1 R70.1
NTC4-: R75.1 R76.1
NTC5-: R79.1 R82.1
NTC6-: R86.1 R88.1
NTC7-: R81.1 R83.1
NTC8-: R87.1 R89.1
NetC85_1: C85.1 C87.2
NetC86_1: C86.1 C88.2
NetC89_2: C89.2 R68.2 U13.3
NetC90_2: C90.2 R69.2 U13.5
NetC93_1: C93.1 C95.2
NetC94_1: C94.1 C96.2
NetC97_2: C97.2 R74.2 U14.5
NetC99_2: C99.2 R75.2 U14.3
NetC101_1: C101.1 C103.2
NetC102_1: C102.1 C104.2
NetC105_2: C105.2 R79.2 U15.5
NetC107_2: C107.2 R81.2 U15.3
NetC109_1: C109.1 C111.2
NetC110_1: C110.1 C112.2
NetC113_2: C113.2 R86.2 U16.3
NetC115_2: C115.2 R87.2 U16.5
NetR66_1: R66.1 U13.1 U13.2
NetR67_1: R67.1 U13.6 U13.7
NetR72_1: R72.1 U14.6 U14.7
NetR73_1: R73.1 U14.1 U14.2
NetR78_1: R78.1 U15.6 U15.7
NetR80_1: R80.1 U15.1 U15.2
NetR84_1: R84.1 U16.1 U16.2
NetR85_1: R85.1 U16.6 U16.7

### Notes on the sheet
- Project:
- BEE-PC1
- Sub-system:
- NANORACK_EXP_CONTROLLER
- Design by:
- SANG HUYNH
- BAO BUI Q.
- Sheet title:
- Sheet
- A3
- of
- Checked by:
- Approved by:
- VU PHAM
- Revision:
- Document No:
- V1.1.1
- Size:
- Date:
- (in symbol OPA2340UA, part A) -; Vcc; GND; +
- (in symbol OPA2340UA, part B) -; Vcc; GND; +

### Library data of the parts
C85-C116 = Capacitors: Value: 33pF
R66-R89 = Res SMD: as R8 on sheet HEADER_1; Published: 08/06/2000; Publisher: Altium Hobart Technology Centre

## Sheet I2C_Sensor.SchDoc
size 420 x 297 mm; SheetNumber: 8; SheetTotal: 11
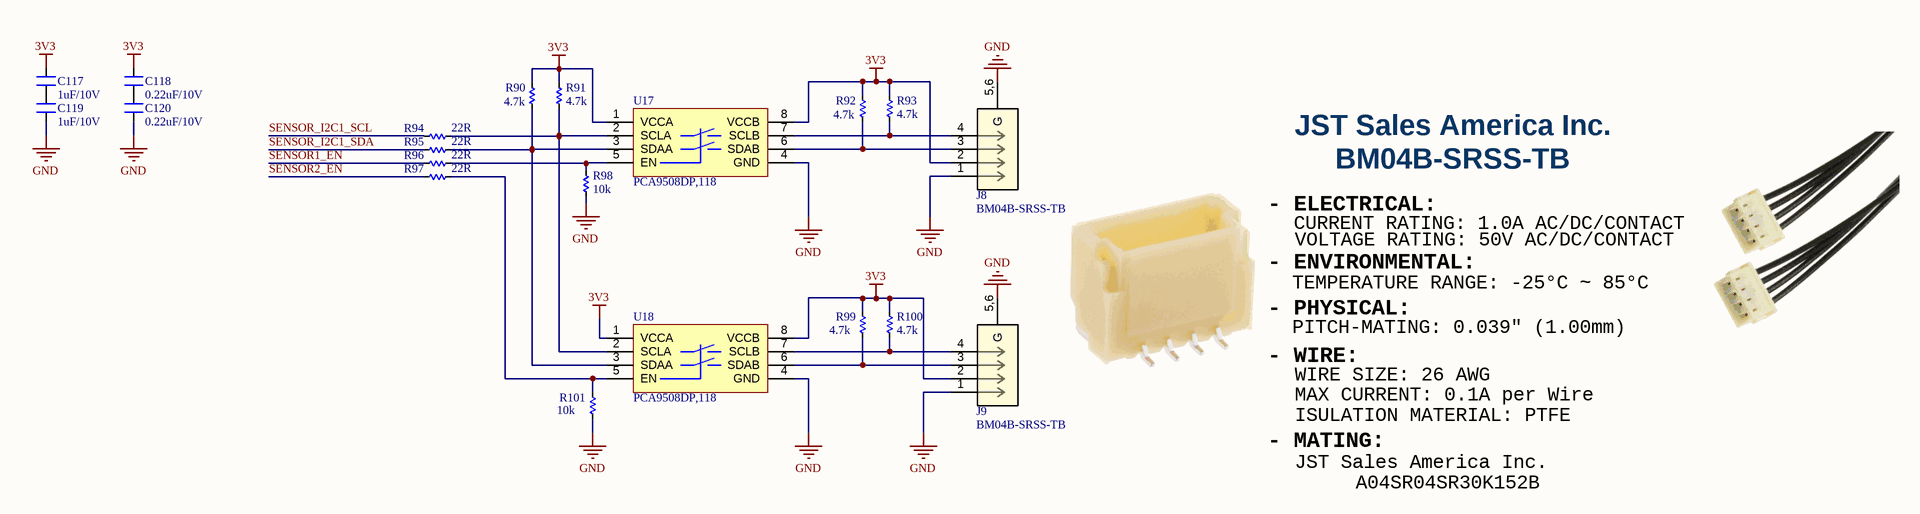
[diagram p8: I2C_Sensor.SchDoc]

### Parts
C117  1uF/10V  [CAP_C_1608X80]
C118  0.22uF/10V  [CAP_C_1608X80]
C119  1uF/10V  [CAP_C_1608X80]
C120  0.22uF/10V  [CAP_C_1608X80]
J8  BM04B-SRSS-TB  [BM04B-SRSS-TB]
J9  BM04B-SRSS-TB  [BM04B-SRSS-TB]
R90  4.7k  [RES_C_1608X60]
R91  4.7k  [RES_C_1608X60]
R92  4.7k  [RES_C_1608X60]
R93  4.7k  [RES_C_1608X60]
R94  22R  [RES_C_1608X60]
R95  22R  [RES_C_1608X60]
R96  22R  [RES_C_1608X60]
R97  22R  [RES_C_1608X60]
R98  10k  [RES_C_1608X60]
R99  4.7k  [RES_C_1608X60]
R100  4.7k  [RES_C_1608X60]
R101  10k  [RES_C_1608X60]
U17  PCA9508DP,118  [TSOP8]
U18  PCA9508DP,118  [TSOP8]

### Nets
3V3: C117.2 C118.2 J8.2 J9.2 R90.1 R91.1 R92.1 R93.1 R99.1 R100.1 U17.1(VCCA) U17.8(VCCB) U18.1(VCCA) U18.8(VCCB)  [project net +3.3]
GND: C119.1 C120.1 J8.1 J8.5,6(G) J9.1 J9.5,6(G) R98.2 R101.2 U17.4(GND) U18.4(GND)
SENSOR1_EN: R96.1
SENSOR2_EN: R97.1
SENSOR_I2C1_SCL: R94.1
SENSOR_I2C1_SDA: R95.1
NetC117_1: C117.1 C119.2
NetC118_1: C118.1 C120.2
NetJ8_3: J8.3 R92.2 U17.6(SDAB)
NetJ8_4: J8.4 R93.2 U17.7(SCLB)
NetJ9_3: J9.3 R99.2 U18.6(SDAB)
NetJ9_4: J9.4 R100.2 U18.7(SCLB)
NetR90_2: R90.2 R95.2 U17.3(SDAA) U18.3(SDAA)
NetR91_2: R91.2 R94.2 U17.2(SCLA) U18.2(SCLA)
NetR96_2: R96.2 R98.1 U17.5(EN)
NetR97_2: R97.2 R101.1 U18.5(EN)

### Notes on the sheet
- JST Sales America Inc.
- - ELECTRICAL:
- BM04B-SRSS-TB
- - ENVIRONMENTAL:
- CURRENT RATING: 1.0A AC/DC/CONTACT
- VOLTAGE RATING: 50V AC/DC/CONTACT
- - PHYSICAL:
- TEMPERATURE RANGE: -25°C ~ 85°C
- PITCH-MATING: 0.039" (1.00mm)
- - WIRE:
- WIRE SIZE: 26 AWG
- MAX CURRENT: 0.1A per Wire
- - MATING:
- ISULATION MATERIAL: PTFE
- A04SR04SR30K152B
- Project:
- BEE-PC1
- Sub-system:
- NANORACK_EXP_CONTROLLER
- Design by:
- SANG HUYNH
- BAO BUI Q.
- Sheet title:
- Sheet
- A3
- of
- Checked by:
- Approved by:
- VU PHAM
- Revision:
- Document No:
- V1.1.1
- Size:
- Date:

### Library data of the parts
C117-C120 = Capacitors: Value: 33pF
J8 J9 = BM04B-SRSS-TB: CONN HEADER SMD 4POS 1MM
R90-R101 = Res SMD: as R8 on sheet HEADER_1; Published: 08/06/2000; Publisher: Altium Hobart Technology Centre

## Sheet IR_LED.SchDoc
size 420 x 297 mm; SheetNumber: 9; SheetTotal: 11
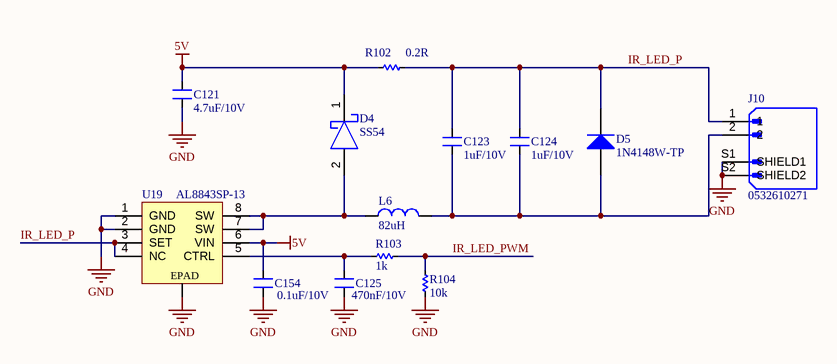
[diagram p9: IR_LED.SchDoc]

### Parts
C121  4.7uF/10V  [CAP_C_1608X80]
C123  1uF/10V  [CAP_C_1608X80]
C124  1uF/10V  [CAP_C_1608X80]
C125  470nF/10V  [CAP_C_1608X80]
C154  0.1uF/10V  [CAP_C_1608X80]
D4  SS54  [DO214-AC-SMA]
D5  1N4148W-TP  [SOD-123]
J10  0532610271  [0532610271]
L6  82uH  [L-SMD-M-4.8x4.8x2.8mm]
R102  0.2R  [RES_C_3216X70]
R103  1k  [RES_C_1608X60]
R104  10k  [RES_C_1608X60]
U19  AL8843SP-13  [SO8_EPAD]

### Nets
5V: C121.2 C154.2 D4.1 R102.2 U19.6(VIN)
GND: C121.1 C125.1 C154.1 J10.S1(SHIELD1) J10.S2(SHIELD2) R104.1 U19.1(GND) U19.2(GND) U19.EPAD
IR_LED_P: C123.2 C124.2 D5.2(K) J10.1 R102.1 U19.3(SET) U19.4(NC)
IR_LED_PWM: R103.2 R104.2
NetC123_1: C123.1 C124.1 D5.1(A) J10.2 L6.2
NetC125_2: C125.2 R103.1 U19.5(CTRL)
NetD4_2: D4.2 L6.1 U19.7(SW) U19.8(SW)

### Notes on the sheet
- Project:
- BEE-PC1
- Sub-system:
- NANORACK_EXP_CONTROLLER
- Design by:
- SANG HUYNH
- BAO BUI Q.
- Sheet title:
- Sheet
- A3
- of
- Checked by:
- Approved by:
- VU PHAM
- Revision:
- Document No:
- V1.1.1
- Size:
- Date:

### Library data of the parts
C121 C123-C125 C154 = Capacitors: Value: 33pF
D4 = SS54: DIODE SCHOTTKY 60V 3A DO214AA
D5 = 1N4148-W-7: DIODE GEN PURP 100V 300MA SOD123; MPN: 1N4148W-7-F; MFR: Diodes Incorporated; Solder: SMT; Value: 100V/300MA
J10 = CONN_SMD_02: CONN HEADER SMD R/A 2POS 1.25MM
L6 = L-SMD-1: SRR4828A-820M; partNo: 78477010; Manufacturer: Wurth Elektronik; Inductance: 1.0 μH; ComponentLink1Description: Manufacturer; ComponentLink1URL: http://www.we-online.de; Created by: Baojun Chen; Created Date: Nov.2015; ComponentLink2Description: Datasheet; ComponentLink2URL: http://katalog.we-online.de/pbs/datasheet/78477010.pdf
R102 = Res-SMD: RES 0.2 OHM 1% 1W 1206; Manufacturer: Generic Components; Class: Passive; Published: 08/06/2000; Publisher: Altium Hobart Technology Centre
R103 R104 = Res SMD: as R8 on sheet HEADER_1; Published: 08/06/2000; Publisher: Altium Hobart Technology Centre
U19 = AL8843SP-13: IC LED DRIVER RGLTR PWM 3A 8SO

## Sheet FRAM.SchDoc
size 420 x 297 mm; SheetNumber: 11; SheetTotal: 13
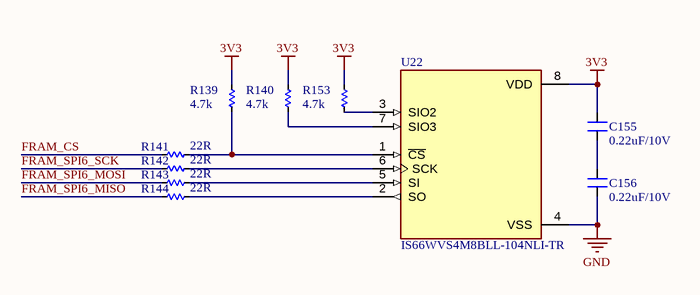
[diagram p10: FRAM.SchDoc]

### Parts
C155  0.22uF/10V  [CAP_C_1608X80]
C156  0.22uF/10V  [CAP_C_1608X80]
R139  4.7k  [RES_C_1608X60]
R140  4.7k  [RES_C_1608X60]
R141  22R  [RES_C_1608X60]
R142  22R  [RES_C_1608X60]
R143  22R  [RES_C_1608X60]
R144  22R  [RES_C_1608X60]
R153  4.7k  [RES_C_1608X60]
U22  IS66WVS4M8BLL-104NLI-TR  [IS66WVS4M8BLL-104NLI-TR]

### Nets
3V3: C155.2 R139.1 R140.1 R153.1 U22.8(VDD)  [project net +3.3]
GND: C156.1 U22.4(VSS)
FRAM_CS: R141.1
FRAM_SPI6_MISO: R144.1
FRAM_SPI6_MOSI: R143.1
FRAM_SPI6_SCK: R142.1
NetC155_1: C155.1 C156.2
NetR139_2: R139.2 R141.2 U22.1(~{CS})
NetR140_2: R140.2 U22.7(SIO3)
NetR142_2: R142.2 U22.6(SCK)
NetR143_2: R143.2 U22.5(SI)
NetR144_2: R144.2 U22.2(SO)
NetR153_2: R153.2 U22.3(SIO2)

### Notes on the sheet
- Project:
- BEE-PC1
- Sub-system:
- NANORACK_EXP_CONTROLLER
- Design by:
- SANG HUYNH
- BAO BUI Q.
- Sheet title:
- Sheet
- A3
- of
- Checked by:
- Approved by:
- VU PHAM
- Revision:
- Document No:
- V1.1.1
- Size:
- Date:

### Library data of the parts
C155 C156 = Capacitors: Value: 33pF
R139-R144 R153 = Res SMD: as R8 on sheet HEADER_1; Published: 08/06/2000; Publisher: Altium Hobart Technology Centre
U22 = IS66WVS4M8BLL-104NLI-TR: IC PSRAM 32MBIT SPI QPI 8SOIC; MF: Fujitsu Electronics; MP: MB85RS2MTAPNF-G-BDERE1; Package: SO-8 Fujitsu; Value: *; Digi-Key_Purchase_URL: https://www.digikey.com/product-detail/en/fujitsu-electronics-america-inc/MB85RS2MTAPNF-G-BDERE1/865-1286-1-ND/7916252?utm_source=snapeda&utm_medium=aggregator&utm_campaign=symbol; Digi-Key_Part_Number: 865-1286-1-ND; SnapEDA_Link: https://www.snapeda.com/parts/MB85RS2MTAPNF-G-BDERE1/Fujitsu%20Electronics%20America%2C%20Inc./view-part/2344795/?ref=snap

## Sheet MCU.SchDoc
size 420 x 297 mm; SheetNumber: 12; SheetTotal: 13
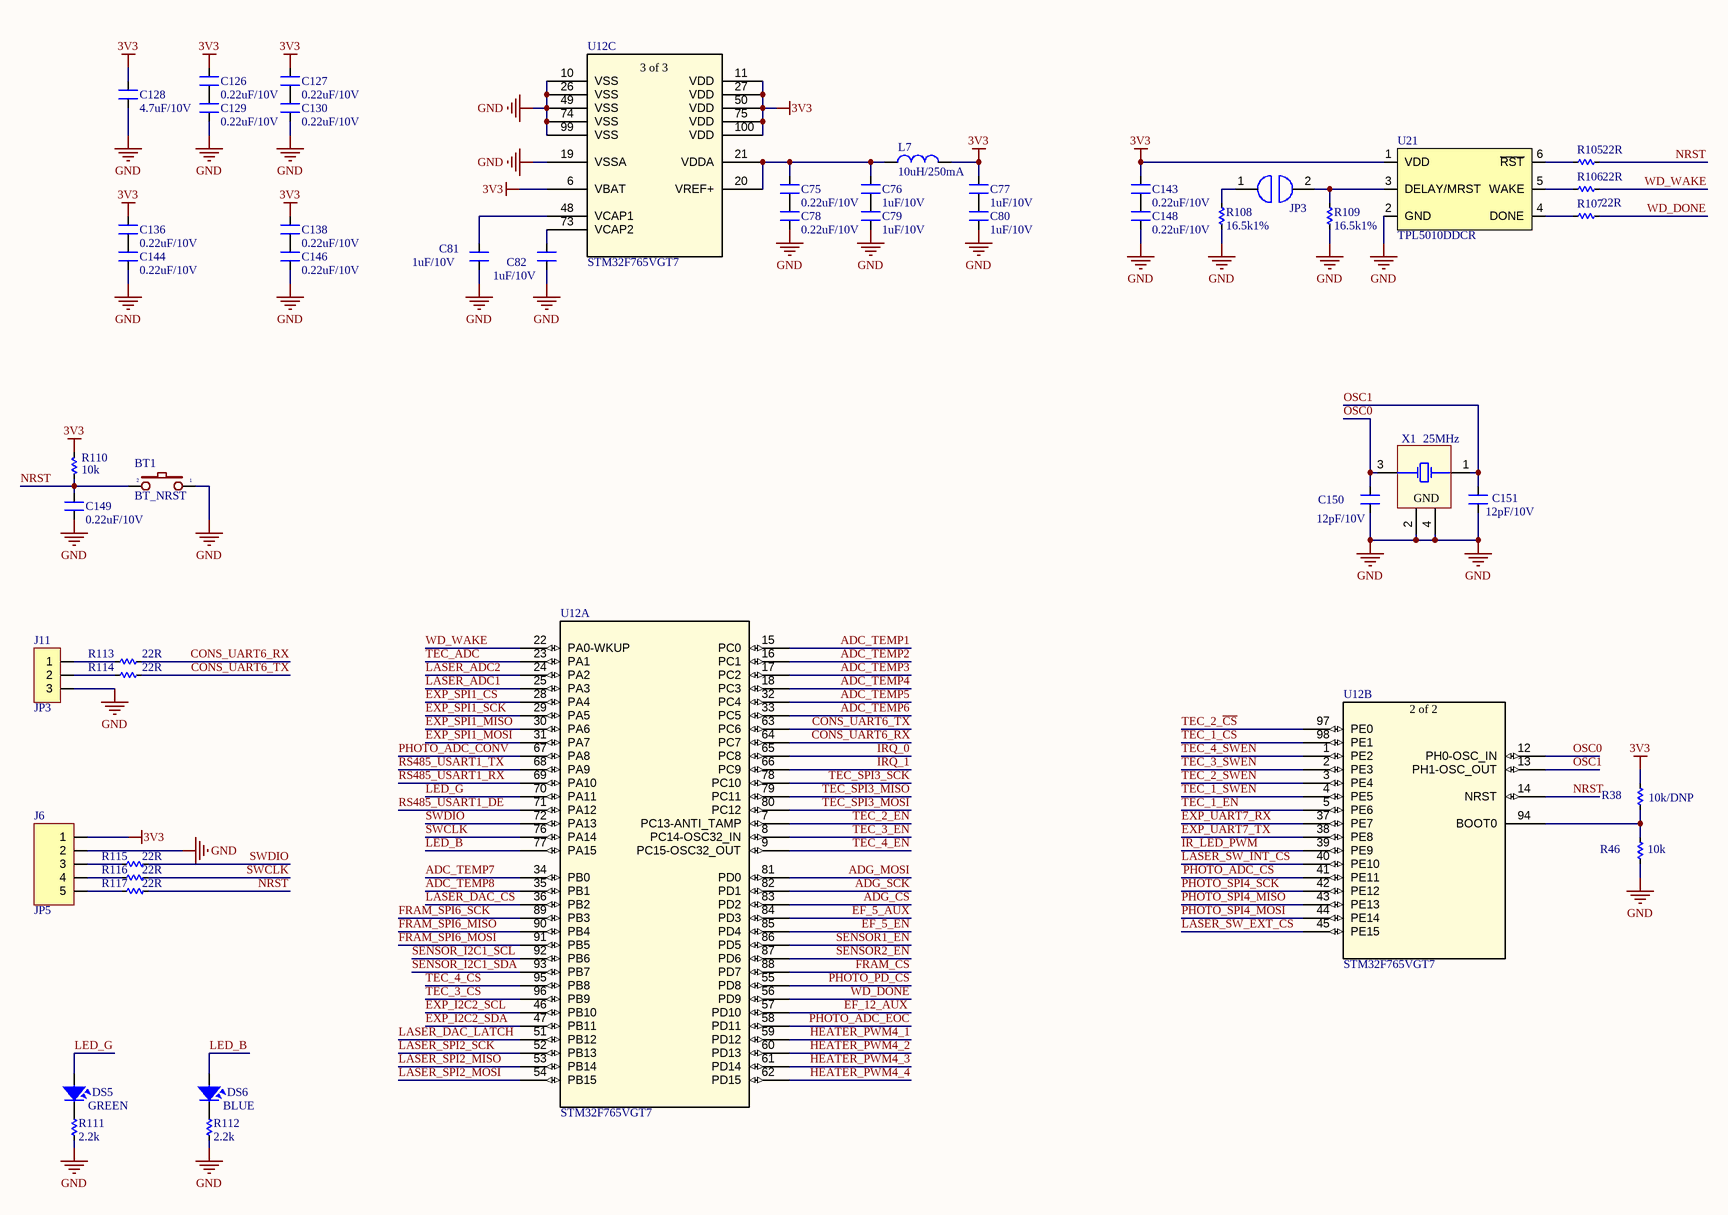
[diagram p11: MCU.SchDoc]

### Parts
BT1  BT_NRST  [SW1-SMD]
C75  0.22uF/10V  [CAP_C_1608X80]
C76  1uF/10V  [CAP_C_1608X80]
C77  1uF/10V  [CAP_C_1608X80]
C78  0.22uF/10V  [CAP_C_1608X80]
C79  1uF/10V  [CAP_C_1608X80]
C80  1uF/10V  [CAP_C_1608X80]
C81  1uF/10V  [CAP_C_1608X80]
C82  1uF/10V  [CAP_C_1608X80]
C126  0.22uF/10V  [CAP_C_1608X80]
C127  0.22uF/10V  [CAP_C_1608X80]
C128  4.7uF/10V  [CAP_C_1608X80]
C129  0.22uF/10V  [CAP_C_1608X80]
C130  0.22uF/10V  [CAP_C_1608X80]
C136  0.22uF/10V  [CAP_C_1608X80]
C138  0.22uF/10V  [CAP_C_1608X80]
C143  0.22uF/10V  [CAP_C_1608X80]
C144  0.22uF/10V  [CAP_C_1608X80]
C146  0.22uF/10V  [CAP_C_1608X80]
C148  0.22uF/10V  [CAP_C_1608X80]
C149  0.22uF/10V  [CAP_C_1608X80]
C150  12pF/10V  [CAP_C_1608X80]
C151  12pF/10V  [CAP_C_1608X80]
DS5  GREEN  [LED-0603-BLUE]
DS6  BLUE  [LED-0603-BLUE]
J6  JP5  [JP5-D1C]
J11  JP3  [JP3-D1C]
JP3  jumper2  [JUMPER2]  (value not drawn)
L7  10uH/250mA  [L-SMD-0603]
R38  10k/DNP  [RES_C_1608X60]
R46  10k  [RES_C_1608X60]
R105  22R  [RES_C_1608X60]
R106  22R  [RES_C_1608X60]
R107  22R  [RES_C_1608X60]
R108  16.5k1%  [RES_C_1608X60]
R109  16.5k1%  [RES_C_1608X60]
R110  10k  [RES_C_1608X60]
R111  2.2k  [RES_C_1608X60]
R112  2.2k  [RES_C_1608X60]
R113  22R  [RES_C_1608X60]
R114  22R  [RES_C_1608X60]
R115  22R  [RES_C_1608X60]
R116  22R  [RES_C_1608X60]
R117  22R  [RES_C_1608X60]
U12  STM32F765VGT7  [LQFP100_STM]  (parts A,B,C of 3)
U21  TPL5010DDCR  [TPL5010DDCR]
X1  25MHz  [XTAL_ECS-250-12-33Q-JES-TR]

### Nets
3V3: C77.2 C126.2 C127.2 C128.2 C136.2 C138.2 C143.2 J6.1 L7.1 R38.1 R110.1 U12.6(VBAT) U12.11(VDD) U12.27(VDD) U12.50(VDD) U12.75(VDD) U12.100(VDD) U21.1(VDD)  [project net +3.3]
GND: BT1.1 C78.1 C79.1 C80.1 C81.1 C82.1 C128.1 C129.1 C130.1 C144.1 C146.1 C148.1 C149.1 C150.2 C151.1 J6.2 J11.3 R46.2 R108.1 R109.1 R111.2 R112.2 U12.10(VSS) U12.19(VSSA) U12.26(VSS) U12.49(VSS) U12.74(VSS) U12.99(VSS) U21.2(GND) X1.2(GND) X1.4(GND)
ADC_TEMP1: U12.15(PC0)
ADC_TEMP2: U12.16(PC1)
ADC_TEMP3: U12.17(PC2)
ADC_TEMP4: U12.18(PC3)
ADC_TEMP5: U12.32(PC4)
ADC_TEMP6: U12.33(PC5)
ADC_TEMP7: U12.34(PB0)
ADC_TEMP8: U12.35(PB1)
ADG_CS: U12.83(PD2)
ADG_MOSI: U12.81(PD0)
ADG_SCK: U12.82(PD1)
CONS_UART6_RX: R113.1 U12.64(PC7)
CONS_UART6_TX: R114.1 U12.63(PC6)
EF_5_AUX: U12.84(PD3)
EF_5_EN: U12.85(PD4)
EF_12_AUX: U12.57(PD10)
EXP_I2C2_SCL: U12.46(PB10)
EXP_I2C2_SDA: U12.47(PB11)
EXP_SPI1_CS: U12.28(PA4)
EXP_SPI1_MISO: U12.30(PA6)
EXP_SPI1_MOSI: U12.31(PA7)
EXP_SPI1_SCK: U12.29(PA5)
EXP_UART7_RX: U12.37(PE7)
EXP_UART7_TX: U12.38(PE8)
FRAM_CS: U12.88(PD7)
FRAM_SPI6_MISO: U12.90(PB4)
FRAM_SPI6_MOSI: U12.91(PB5)
FRAM_SPI6_SCK: U12.89(PB3)
HEATER_PWM4_1: U12.59(PD12)
HEATER_PWM4_2: U12.60(PD13)
HEATER_PWM4_3: U12.61(PD14)
HEATER_PWM4_4: U12.62(PD15)
IR_LED_PWM: U12.39(PE9)
IRQ_0: U12.65(PC8)
IRQ_1: U12.66(PC9)
LASER_ADC1: U12.25(PA3)
LASER_ADC2: U12.24(PA2)
LASER_DAC_CS: U12.36(PB2)
LASER_DAC_LATCH: U12.51(PB12)
LASER_SPI2_MISO: U12.53(PB14)
LASER_SPI2_MOSI: U12.54(PB15)
LASER_SPI2_SCK: U12.52(PB13)
LASER_SW_EXT_CS: U12.45(PE15)
LASER_SW_INT_CS: U12.40(PE10)
LED_B: DS6.1 U12.77(PA15)
LED_G: DS5.1 U12.70(PA11)
NRST: BT1.2 C149.2 R105.2 R110.2 R117.1 U12.14(NRST)
OSC0: C150.1 U12.12(PH0-OSC_IN) X1.3(XTAL)
OSC1: C151.2 U12.13(PH1-OSC_OUT) X1.1(XTAL)
PHOTO_ADC_CONV: U12.67(PA8)
PHOTO_ADC_CS: U12.41(PE11)
PHOTO_ADC_EOC: U12.58(PD11)
PHOTO_PD_CS: U12.55(PD8)
PHOTO_SPI4_MISO: U12.43(PE13)
PHOTO_SPI4_MOSI: U12.44(PE14)
PHOTO_SPI4_SCK: U12.42(PE12)
RS485_USART1_DE: U12.71(PA12)
RS485_USART1_RX: U12.69(PA10)
RS485_USART1_TX: U12.68(PA9)
SENSOR1_EN: U12.86(PD5)
SENSOR2_EN: U12.87(PD6)
SENSOR_I2C1_SCL: U12.92(PB6)
SENSOR_I2C1_SDA: U12.93(PB7)
SWCLK: R116.1 U12.76(PA14)
SWDIO: R115.1 U12.72(PA13)
TEC_1_~{CS}: U12.98(PE1)
TEC_1_EN: U12.5(PE6)
TEC_1_SWEN: U12.4(PE5)
TEC_2_~{CS}: U12.97(PE0)
TEC_2_EN: U12.7(PC13-ANTI_TAMP)
TEC_2_SWEN: U12.3(PE4)
TEC_3_~{CS}: U12.96(PB9)
TEC_3_EN: U12.8(PC14-OSC32_IN)
TEC_3_SWEN: U12.2(PE3)
TEC_4_~{CS}: U12.95(PB8)
TEC_4_EN: U12.9(PC15-OSC32_OUT)
TEC_4_SWEN: U12.1(PE2)
TEC_ADC: U12.23(PA1)
TEC_SPI3_MISO: U12.79(PC11)
TEC_SPI3_MOSI: U12.80(PC12)
TEC_SPI3_SCK: U12.78(PC10)
WD_DONE: R107.2 U12.56(PD9)
WD_WAKE: R106.2 U12.22(PA0-WKUP)
NetC75_1: C75.1 C78.2
NetC75_2: C75.2 C76.2 L7.2 U12.20(VREF+) U12.21(VDDA)
NetC76_1: C76.1 C79.2
NetC77_1: C77.1 C80.2
NetC81_2: C81.2 U12.48(VCAP1)
NetC82_2: C82.2 U12.73(VCAP2)
NetC126_1: C126.1 C129.2
NetC127_1: C127.1 C130.2
NetC136_1: C136.1 C144.2
NetC138_1: C138.1 C146.2
NetC143_1: C143.1 C148.2
NetDS5_2: DS5.2 R111.1
NetDS6_2: DS6.2 R112.1
NetJ6_3: J6.3 R115.2
NetJ6_4: J6.4 R116.2
NetJ6_5: J6.5 R117.2
NetJ11_1: J11.1 R113.2
NetJ11_2: J11.2 R114.2
NetJP3_1: JP3.1 R108.2
NetJP3_2: JP3.2 R109.2 U21.3(DELAY/MRST)
NetR38_2: R38.2 R46.1 U12.94(BOOT0)
NetR105_1: R105.1 U21.6(~{RST})
NetR106_1: R106.1 U21.5(WAKE)
NetR107_1: R107.1 U21.4(DONE)

### Notes on the sheet
- Project:
- BEE-PC1
- Sub-system:
- NANORACK_EXP_CONTROLLER
- Design by:
- SANG HUYNH
- BAO BUI Q.
- Sheet title:
- Sheet
- A3
- of
- Checked by:
- Approved by:
- VU PHAM
- Revision:
- Document No:
- V1.1.1
- Size:
- Date:
- (in symbol STM32F765VGT7, part B) 2 of 2
- (in symbol STM32F765VGT7, part C) 3 of 3

### Library data of the parts
BT1 = SW2: Switch button 2 pin; Value: SW chip 2 pin
C75-C82 C126-C130 C136 C138 C143 C144 C146 C148-C151 = Capacitors: Value: 33pF
DS5 DS6 = LED SMD: Value: LED 3 - 5 ly 2 Colour
J6 = JP5: WR-PHD 2.54 mm Angled Socket Header; Manufacturer: W¨¹rth Elektronik eiSos GmbH; partNo: 613005143121; ComponentLink1 Description: Manufacturer; ComponentLink2 Description: Datasheet; NoPins: 05; Created Date: 29 March 2013; ComponentLink1URL: http://www.we-online.com; ComponentLink2URL: http://katalog.we-online.de/em/datasheet/6130xx143121.pdf; Created by: Karrer Zheng
J11 = JP3: WR-PHD 2.54 mm Angled Socket Header; Manufacturer: W¨¹rth Elektronik eiSos GmbH; partNo: 613003143121; ComponentLink1 Description: Manufacturer; ComponentLink2 Description: Datasheet; NoPins: 03; Created Date: 29 March 2013; ComponentLink1URL: http://www.we-online.com; ComponentLink2URL: http://katalog.we-online.de/em/datasheet/6130xx143121.pdf; Created by: Karrer Zheng
JP3 = JUMPER
L7 = L-SMD-1: as L2 on sheet TEC_DRV; ComponentLink1Description: Manufacturer; ComponentLink1URL: http://www.we-online.de; Created by: Baojun Chen; Created Date: Nov.2015; ComponentLink2Description: Datasheet; ComponentLink2URL: http://katalog.we-online.de/pbs/datasheet/78477010.pdf
R38 R46 R105-R117 = Res SMD: as R8 on sheet HEADER_1; Published: 08/06/2000; Publisher: Altium Hobart Technology Centre
U12 = STM32F765VGT7: No Description Available; Mfr_Name: STMicroelectronics; RefDes: RefDes; Type: Type
U21 = TPL5010DDCR: IC OSC PROG TIMER TSOT23-6
X1 = XT4: Crystal, 8 MHz, -30 to 85 degC, 3.2 x 2.5 x 0.9 mm SMD; Value: 4Mhz

## Sheet RS485.SchDoc
size 420 x 297 mm; SheetNumber: 13; SheetTotal: 13
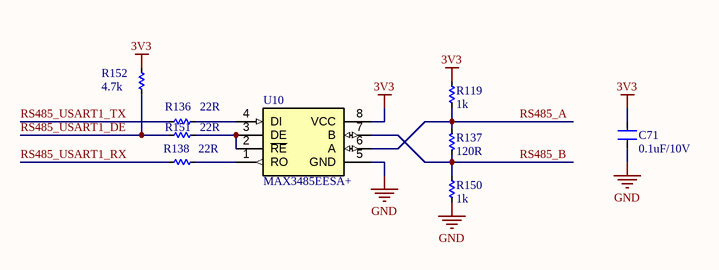
[diagram p12: RS485.SchDoc]

### Parts
C71  0.1uF/10V  [CAP_C_1608X80]
R119  1k  [RES_C_1608X60]
R136  22R  [RES_C_1608X60]
R137  120R  [RES_C_1608X60]
R138  22R  [RES_C_1608X60]
R150  1k  [RES_C_1608X60]
R151  22R  [RES_C_1608X60]
R152  4.7k  [RES_C_1608X60]
U10  MAX3485EESA+  [SOIC8_3.9mm]

### Nets
3V3: C71.2 R119.2 R152.1 U10.8(VCC)  [project net +3.3]
GND: C71.1 R150.1 U10.5(GND)
RS485_A: R119.1 R137.1 U10.6(A)
RS485_B: R137.2 R150.2 U10.7(B)
RS485_USART1_DE: R151.1 R152.2
RS485_USART1_RX: R138.1
RS485_USART1_TX: R136.1
NetR136_2: R136.2 U10.4(DI)
NetR138_2: R138.2 U10.1(RO)
NetR151_2: R151.2 U10.2(~{RE}) U10.3(DE)

### Notes on the sheet
- Project:
- BEE-PC1
- Sub-system:
- NANORACK_EXP_CONTROLLER
- Design by:
- SANG HUYNH
- BAO BUI Q.
- Sheet title:
- Sheet
- A3
- of
- Checked by:
- Approved by:
- VU PHAM
- Revision:
- Document No:
- V1.1.1
- Size:
- Date:

### Library data of the parts
C71 = Capacitors: Value: 33pF
R119 R136-R138 R150-R152 = Res SMD: as R8 on sheet HEADER_1; Published: 08/06/2000; Publisher: Altium Hobart Technology Centre
U10 = MAX3485EESA+: 3.3V Powered, Â±15kV ESD-Protected, 12Mbps, Slew-Rate-Limited True RS-485/RS-422 Transceivers; MF: Analog Devices; SnapEDA_Link: https://www.snapeda.com/parts/MAX3485EESA+/Analog+Devices/view-part/?ref=snap; Package: SOIC-8 Maxim; Value: *; MP: MAX3485EESA+; Check_prices: https://www.snapeda.com/parts/MAX3485EESA+/Analog+Devices/view-part/?ref=eda

## Nets that join several sheets
5V: POWER (16 pins), IR_LED (5 pins)
5V_TEMP: HEADER_2 (J5.10 J5.12 J5.14 J5.16), POWER (5 pins), TEC_DRV (20 pins), HEATER (C83.2 C84.2 C122.2 C139.2)
12V: POWER (8 pins), TEC_DRV (U9.23)
12V_EXP: HEADER_1 (6 pins), POWER (7 pins)
+3.3: HEADER_1 (7 pins), HEADER_2 (8 pins), POWER (9 pins), TEC_DRV (13 pins), NTC (12 pins), I2C_Sensor (14 pins), FRAM (5 pins), MCU (18 pins), RS485 (C71.2 R119.2 R152.1 U10.8)
GND: HEADER_1 (13 pins), POWER (42 pins), TEC_DRV (56 pins), HEATER (12 pins), NTC (36 pins), I2C_Sensor (10 pins), IR_LED (9 pins), FRAM (C156.1 U22.4), MCU (31 pins), RS485 (C71.1 R150.1 U10.5)
ADC_TEMP1: NTC (C92.2 R66.2), MCU (U12.15)
ADC_TEMP2: NTC (C98.2 R72.2), MCU (U12.16)
ADC_TEMP3: NTC (C91.2 R67.2), MCU (U12.17)
ADC_TEMP4: NTC (C100.2 R73.2), MCU (U12.18)
ADC_TEMP5: NTC (C106.2 R78.2), MCU (U12.32)
ADC_TEMP6: NTC (C114.2 R84.2), MCU (U12.33)
ADC_TEMP7: NTC (C108.2 R80.2), MCU (U12.34)
ADC_TEMP8: NTC (C116.2 R85.2), MCU (U12.35)
ADG_CS: TEC_DRV (U9.21), MCU (U12.83)
ADG_MOSI: TEC_DRV (U9.24), MCU (U12.81)
ADG_SCK: TEC_DRV (U9.22), MCU (U12.82)
EF_5_AUX: POWER (R15.2), MCU (U12.84)
EF_5_EN: POWER (R13.1), MCU (U12.85)
EF_12_AUX: POWER (R4.2), MCU (U12.57)
EXP_I2C2_SCL: HEADER_1 (R42.2 R45.1), MCU (U12.46)
EXP_I2C2_SDA: HEADER_1 (R43.2 R47.2), MCU (U12.47)
EXP_SPI1_CS: HEADER_1 (R52.1 R56.2), MCU (U12.28)
EXP_SPI1_MISO: HEADER_1 (R53.2), MCU (U12.30)
EXP_SPI1_MOSI: HEADER_1 (R40.2 R51.2), MCU (U12.31)
EXP_SPI1_SCK: HEADER_1 (R50.1), MCU (U12.29)
EXP_UART7_RX: HEADER_1 (R48.1), MCU (U12.37)
EXP_UART7_TX: HEADER_1 (R49.2), MCU (U12.38)
FRAM_CS: FRAM (R141.1), MCU (U12.88)
FRAM_SPI6_MISO: FRAM (R144.1), MCU (U12.90)
FRAM_SPI6_MOSI: FRAM (R143.1), MCU (U12.91)
FRAM_SPI6_SCK: FRAM (R142.1), MCU (U12.89)
HEATER_1_B: HEADER_2 (J5.9), HEATER (Q1.2)
HEATER_2_B: HEADER_2 (J5.11), HEATER (Q2.2)
HEATER_3_B: HEADER_2 (J5.13), HEATER (Q3.2)
HEATER_4_B: HEADER_2 (J5.15), HEATER (Q4.2)
HEATER_PWM4_1: HEATER (R58.1), MCU (U12.59)
HEATER_PWM4_2: HEATER (R59.1), MCU (U12.60)
HEATER_PWM4_3: HEATER (R60.1), MCU (U12.61)
HEATER_PWM4_4: HEATER (R61.1), MCU (U12.62)
IR_LED_PWM: IR_LED (R103.2 R104.2), MCU (U12.39)
IRQ_0: HEADER_1 (R44.2 R55.2), MCU (U12.65)
IRQ_1: HEADER_1 (R41.2 R54.1), MCU (U12.66)
LASER_ADC1: HEADER_1 (C152.2 R126.2), MCU (U12.25)
LASER_ADC2: HEADER_1 (C153.2 R127.2), MCU (U12.24)
LASER_DAC_CS: HEADER_1 (R123.1), MCU (U12.36)
LASER_DAC_LATCH: HEADER_1 (R125.1), MCU (U12.51)
LASER_SPI2_MISO: HEADER_1 (R122.2), MCU (U12.53)
LASER_SPI2_MOSI: HEADER_1 (R124.2), MCU (U12.54)
LASER_SPI2_SCK: HEADER_1 (R120.2), MCU (U12.52)
LASER_SW_EXT_CS: HEADER_1 (R121.1), MCU (U12.45)
LASER_SW_INT_CS: HEADER_1 (R8.1), MCU (U12.40)
NTC1-: HEADER_2 (J7.2), NTC (R68.1 R71.1)
NTC2-: HEADER_2 (J7.4), NTC (R74.1 R77.1)
NTC3-: HEADER_2 (J7.6), NTC (R69.1 R70.1)
NTC4-: HEADER_2 (J7.8), NTC (R75.1 R76.1)
NTC5-: HEADER_2 (J7.10), NTC (R79.1 R82.1)
NTC6-: HEADER_2 (J7.12), NTC (R86.1 R88.1)
NTC7-: HEADER_2 (J7.14), NTC (R81.1 R83.1)
NTC8-: HEADER_2 (J7.16), NTC (R87.1 R89.1)
PHOTO_ADC_CONV: HEADER_1 (R133.2), MCU (U12.67)
PHOTO_ADC_CS: HEADER_1 (R132.2), MCU (U12.41)
PHOTO_ADC_EOC: HEADER_1 (R134.2), MCU (U12.58)
PHOTO_PD_CS: HEADER_1 (R131.2), MCU (U12.55)
PHOTO_SPI4_MISO: HEADER_1 (R129.2), MCU (U12.43)
PHOTO_SPI4_MOSI: HEADER_1 (R130.2), MCU (U12.44)
PHOTO_SPI4_SCK: HEADER_1 (R128.2), MCU (U12.42)
PROTECT_EMI: HEADER_1 (J1.3 J1.24 J12.13), HEADER_2 (Hole1.1 Hole2.1 Hole3.1 Hole4.1)
RS485_A: HEADER_1 (R57.2), RS485 (R119.1 R137.1 U10.6)
RS485_B: HEADER_1 (R118.2), RS485 (R137.2 R150.2 U10.7)
RS485_USART1_DE: MCU (U12.71), RS485 (R151.1 R152.2)
RS485_USART1_RX: MCU (U12.69), RS485 (R138.1)
RS485_USART1_TX: MCU (U12.68), RS485 (R136.1)
SENSOR1_EN: I2C_Sensor (R96.1), MCU (U12.86)
SENSOR2_EN: I2C_Sensor (R97.1), MCU (U12.87)
SENSOR_I2C1_SCL: I2C_Sensor (R94.1), MCU (U12.92)
SENSOR_I2C1_SDA: I2C_Sensor (R95.1), MCU (U12.93)
TEC_1_A: HEADER_2 (J5.1), TEC_DRV (C30.2 C31.2 C35.2 U5.8,9)
TEC_1_B: HEADER_2 (J5.2), TEC_DRV (C35.1 C42.2 L2.2 U5.12)
TEC_1_~{CS}: TEC_DRV (R145.2 U5.15), MCU (U12.98)
TEC_1_EN: TEC_DRV (R23.1), MCU (U12.5)
TEC_1_SWEN: TEC_DRV (R21.1), MCU (U12.4)
TEC_2_A: HEADER_2 (J5.3), TEC_DRV (C32.2 C33.2 C34.2 U6.8,9)
TEC_2_B: HEADER_2 (J5.4), TEC_DRV (C34.1 C43.2 L3.2 U6.12)
TEC_2_~{CS}: TEC_DRV (R146.2 U6.15), MCU (U12.97)
TEC_2_EN: TEC_DRV (R24.1), MCU (U12.7)
TEC_2_SWEN: TEC_DRV (R22.1), MCU (U12.3)
TEC_3_A: HEADER_2 (J5.5), TEC_DRV (C54.2 C55.2 C58.2 U7.8,9)
TEC_3_B: HEADER_2 (J5.6), TEC_DRV (C58.1 C66.2 L4.2 U7.12)
TEC_3_~{CS}: TEC_DRV (R147.2 U7.15), MCU (U12.96)
TEC_3_EN: TEC_DRV (R31.1), MCU (U12.8)
TEC_3_SWEN: TEC_DRV (R29.1), MCU (U12.2)
TEC_4_A: HEADER_2 (J5.7), TEC_DRV (C56.2 C57.2 C59.2 U8.8,9)
TEC_4_B: HEADER_2 (J5.8), TEC_DRV (C59.1 C67.2 L5.2 U8.12)
TEC_4_~{CS}: TEC_DRV (R148.2 U8.15), MCU (U12.95)
TEC_4_EN: TEC_DRV (R32.1), MCU (U12.9)
TEC_4_SWEN: TEC_DRV (R30.1), MCU (U12.1)
TEC_ADC: TEC_DRV (C70.2 R39.1), MCU (U12.23)
TEC_SPI3_MISO: TEC_DRV (U5.18 U6.18 U7.18 U8.18), MCU (U12.79)
TEC_SPI3_MOSI: TEC_DRV (U5.17 U6.17 U7.17 U8.17), MCU (U12.80)
TEC_SPI3_SCK: TEC_DRV (U5.16 U6.16 U7.16 U8.16), MCU (U12.78)